# EAGLE design PSPS_AVNC_SRD_CS_combined-2021-02-07 (EAGLE 9.6.2)

## Sheet 1 of 2: Main Processor
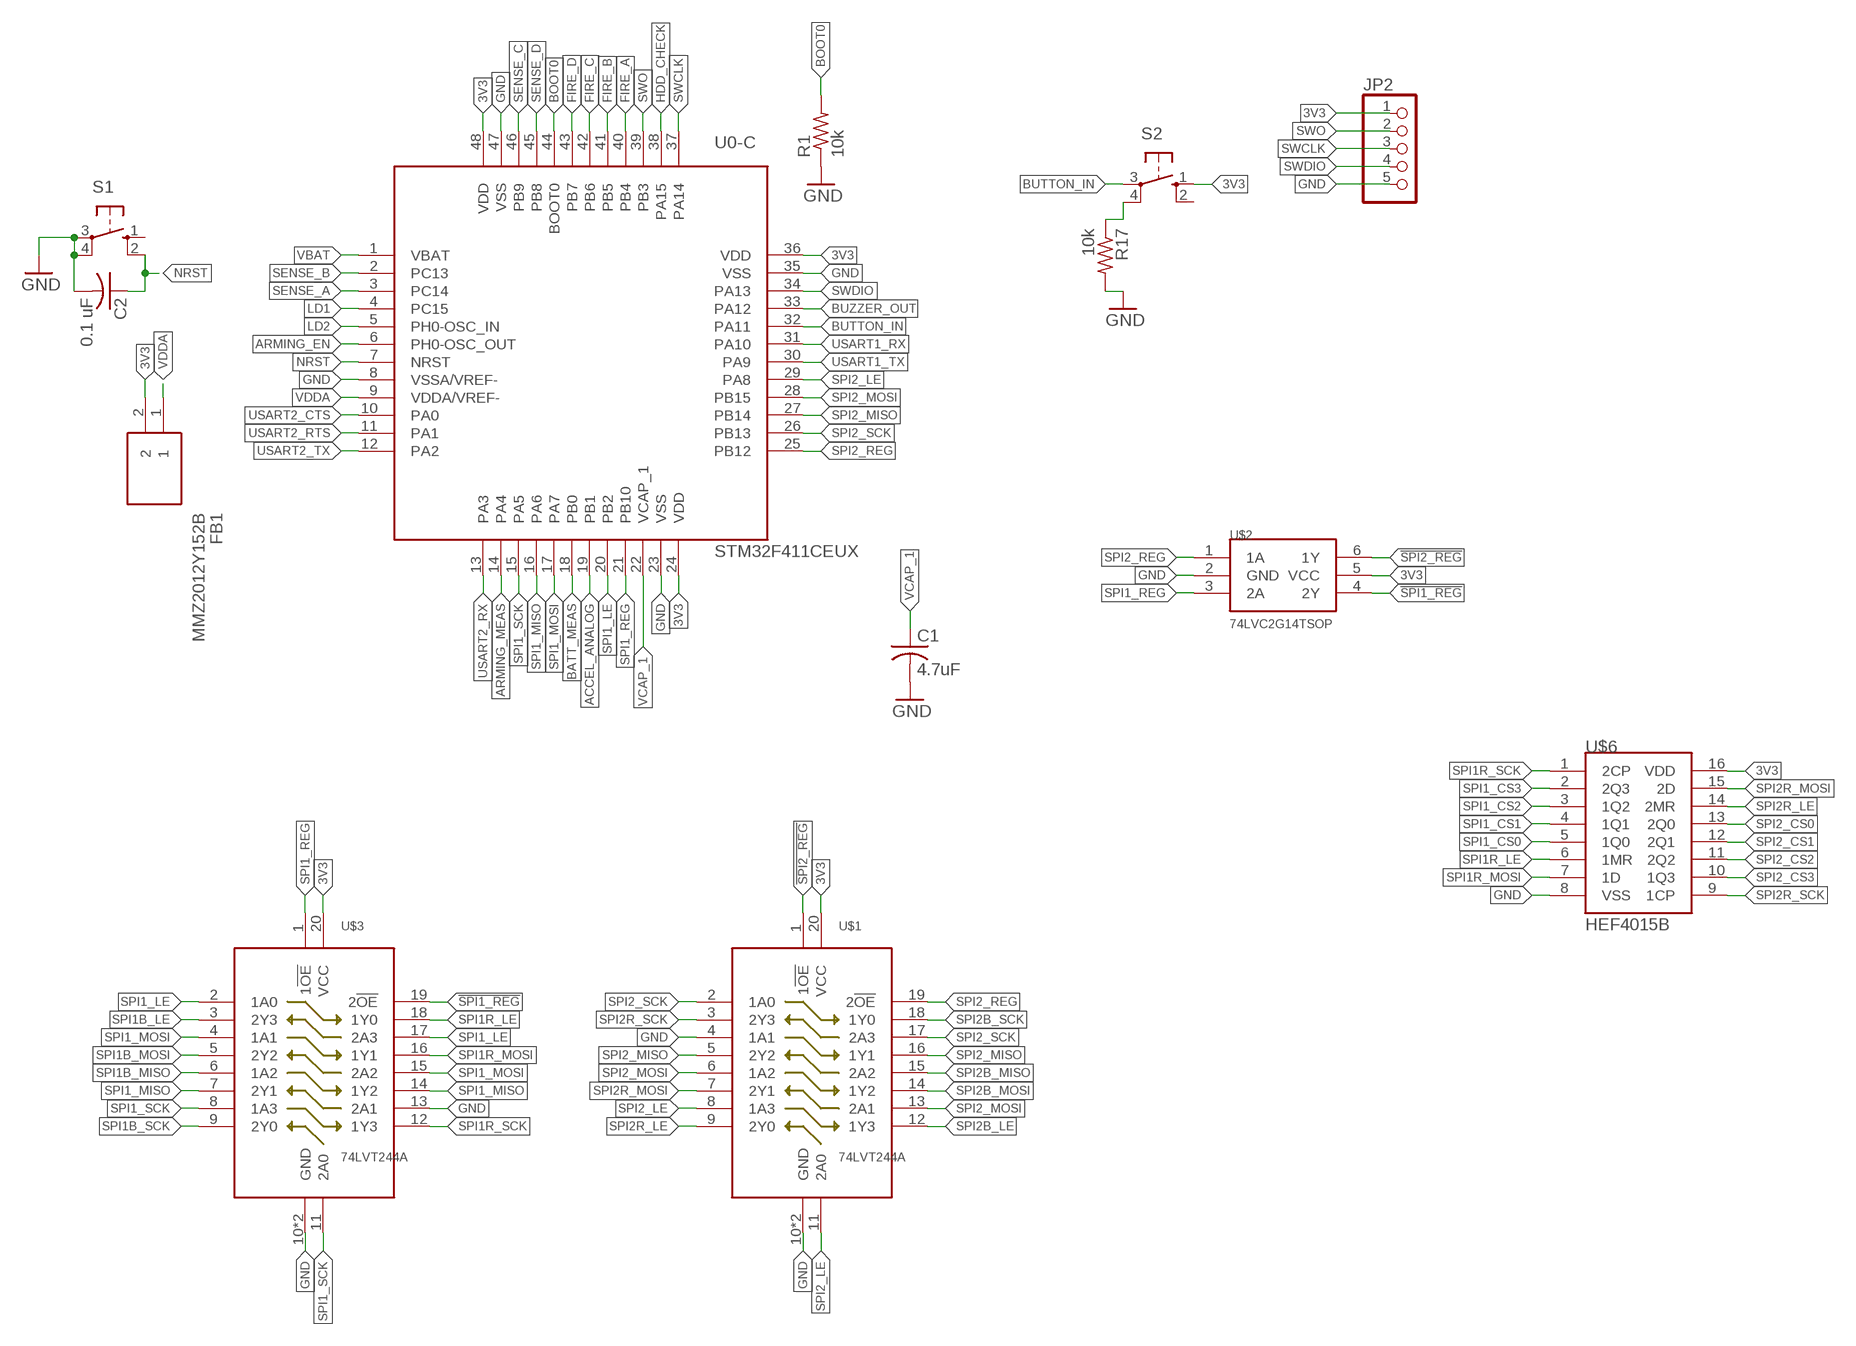
[diagram p0: schematic, sheet 1, part 1 of 2]
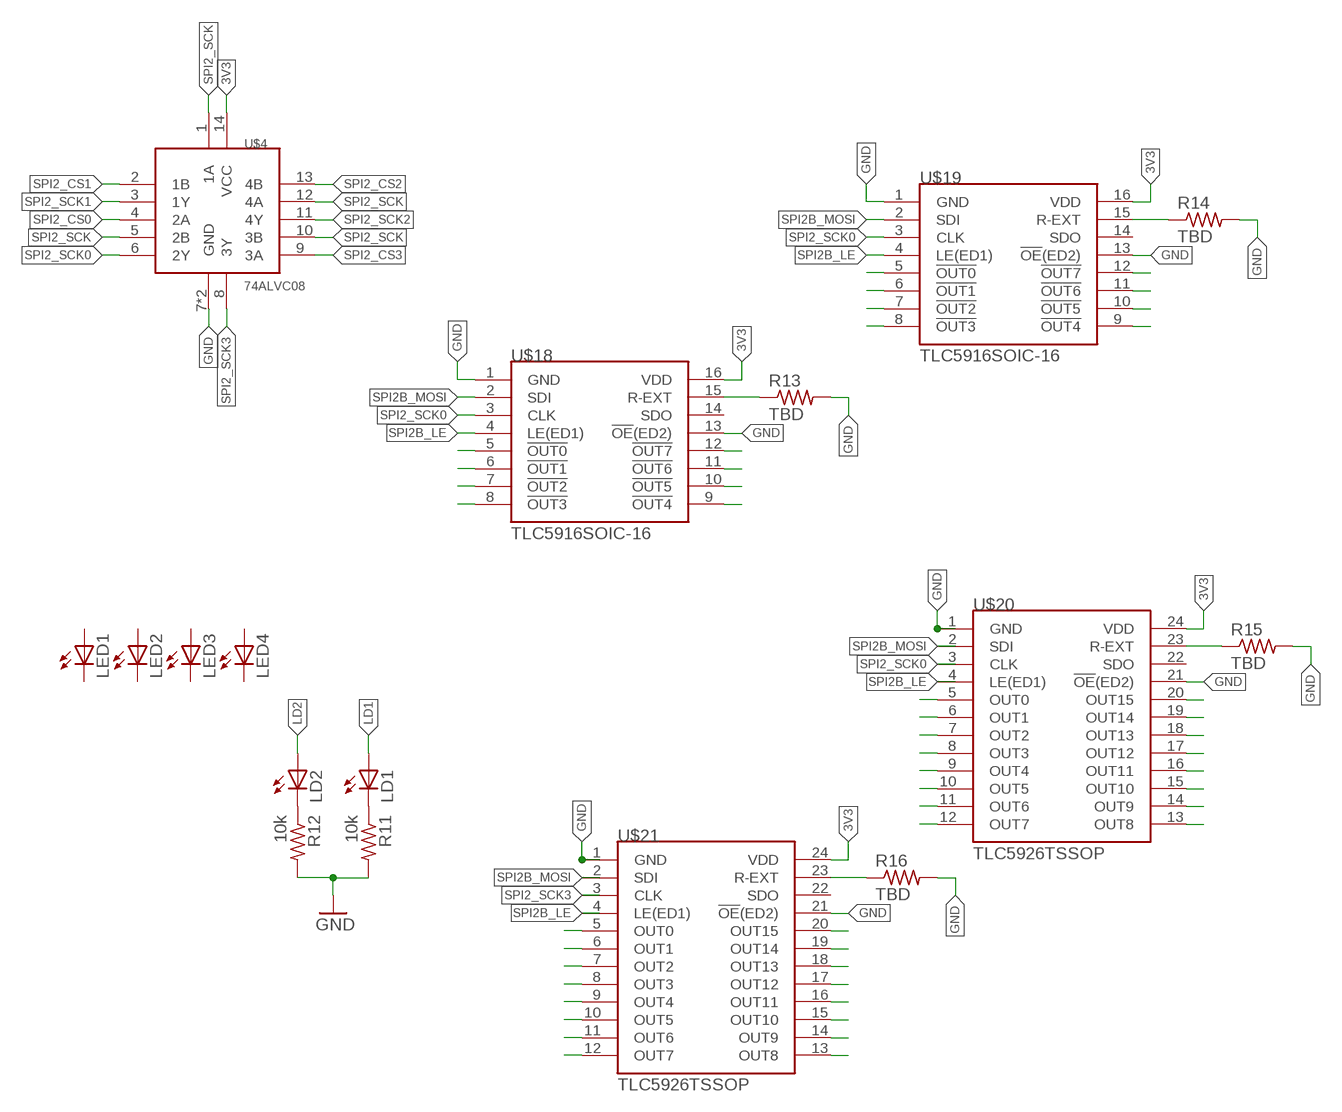
[diagram p1: schematic, sheet 1, part 2 of 2]

### Parts
C1  4.7uF  C-USC0805  [C0805]
C2  0.1 uF  C-USC0805  [C0805]
FB1  MMZ2012Y152B  [BEADC2012X105N]
JP2  PINHD-1X5  [1X05]
LD1  LEDCHIP-LED0805  [CHIP-LED0805]
LD2  LEDCHIP-LED0805  [CHIP-LED0805]
LED1  LEDCHIP-LED0805  [CHIP-LED0805]
LED2  LEDCHIP-LED0805  [CHIP-LED0805]
LED3  LEDCHIP-LED0805  [CHIP-LED0805]
LED4  LEDCHIP-LED0805  [CHIP-LED0805]
R1  10k  R-US_M0805  [M0805]
R11  10k  R-US_M0805  [M0805]
R12  10k  R-US_M0805  [M0805]
R13  TBD  R-US_M0805  [M0805]
R14  TBD  R-US_M0805  [M0805]
R15  TBD  R-US_M0805  [M0805]
R16  TBD  R-US_M0805  [M0805]
R17  10k  R-US_M0805  [M0805]
S1  10-XX  [B3F-10XX]
S2  10-XX  [B3F-10XX]
U0-C  STM32F411CEUX  [QFN50P700X700X50-49T560N]
U$1  74LVT244A  [QFN50P450X250X100-21T300X100N]
U$2  74LVC2G14TSOP  [SOP95P280X110-6N]
U$3  74LVT244A  [QFN50P450X250X100-21T300X100N]
U$4  74ALVC08  [QFN50P300X250X100-15T150X100N]
U$6  HEF4015B  [SOIC127P600X265-16N]
U$18  TLC5916SOIC-16  [SOIC127P600X175-16N]
U$19  TLC5916SOIC-16  [SOIC127P600X175-16N]
U$20  TLC5926TSSOP  [SOP65P640X120-24N]
U$21  TLC5926TSSOP  [SOP65P640X120-24N]

### Nets
3V3: FB1.2 JP2.1 S2.1(S) U0-C.24(VDD) U0-C.36(VDD) U0-C.48(VDD) U$1.20(VCC) U$2.5(VCC) U$3.20(VCC) U$4.14(VCC) U$6.16(VDD) U$18.16(VDD) U$19.16(VDD) U$20.24(VDD) U$21.24(VDD) ; also sheet 2
!SPI1_REG!: U$2.4(2Y) U$3.19(2!OE!)
!SPI2_REG!: U$1.1(1!OE!) U$2.6(1Y)
ACCEL_ANALOG: U0-C.19(PB1) ; also sheet 2
ARMING_EN: U0-C.6(PH0-OSC_OUT)
ARMING_MEAS: U0-C.14(PA4)
BATT_MEAS: U0-C.18(PB0)
BOOT0: R1.2 U0-C.44(BOOT0)
BUTTON_IN: S2.3(P) U0-C.32(PA11)
BUZZER_OUT: U0-C.33(PA12) ; also sheet 2
FIRE_A: U0-C.40(PB4)
FIRE_B: U0-C.41(PB5)
FIRE_C: U0-C.42(PB6)
FIRE_D: U0-C.43(PB7)
GND: C1.2 C2.2 JP2.5 R1.1 R11.2 R12.2 R13.2 R14.2 R15.2 R16.2 R17.2 S1.3(P) S1.4(P1) U0-C.8(VSSA/VREF-) U0-C.23(VSS) U0-C.35(VSS) U0-C.47(VSS) U$1.4(1A1) U$1.10(GND) U$1.21(GND) U$2.2(GND) U$3.10(GND) U$3.13(2A1) U$3.21(GND) U$4.7(GND) U$4.15(GND) U$6.8(VSS) U$18.1(GND) U$18.13(!OE!(ED2)) U$19.1(GND) U$19.13(!OE!(ED2)) U$20.1(GND) U$20.21(!OE!(ED2)) U$21.1(GND) U$21.21(!OE!(ED2)) ; also sheet 2
HDD_CHECK: U0-C.38(PA15)
LD1: LD1.A U0-C.4(PC15)
LD2: LD2.A U0-C.5(PH0-OSC_IN)
N$6: LD1.C R11.1
N$7: LD2.C R12.1
N$8: R13.1 U$18.15(R-EXT)
N$9: R14.1 U$19.15(R-EXT)
N$10: R15.1 U$20.23(R-EXT)
N$11: R16.1 U$21.23(R-EXT)
N$12: U$19.5(!OUT0!)
N$13: U$19.6(!OUT1!)
N$14: U$19.7(!OUT2!)
N$15: U$19.8(!OUT3)
N$16: U$19.12(!OUT7!)
N$17: U$19.11(!OUT6!)
N$18: U$19.10(!OUT5!)
N$19: U$19.9(!OUT4!)
N$20: U$18.5(!OUT0!)
N$21: U$18.6(!OUT1!)
N$22: U$18.7(!OUT2!)
N$23: U$18.8(!OUT3)
N$24: U$18.12(!OUT7!)
N$25: U$18.11(!OUT6!)
N$26: U$18.10(!OUT5!)
N$27: U$18.9(!OUT4!)
N$28: U$20.20(OUT15)
N$29: U$20.19(OUT14)
N$30: U$20.18(OUT13)
N$31: U$20.17(OUT12)
N$32: U$20.16(OUT11)
N$33: U$20.15(OUT10)
N$34: U$20.14(OUT9)
N$35: U$20.13(OUT8)
N$36: U$21.20(OUT15)
N$37: U$21.19(OUT14)
N$38: U$21.18(OUT13)
N$39: U$21.17(OUT12)
N$40: U$21.16(OUT11)
N$41: U$21.15(OUT10)
N$42: U$21.14(OUT9)
N$43: U$21.13(OUT8)
N$44: U$21.5(OUT0)
N$45: U$21.6(OUT1)
N$46: U$21.7(OUT2)
N$47: U$21.8(OUT3)
N$48: U$21.9(OUT4)
N$49: U$21.10(OUT5)
N$50: U$21.11(OUT6)
N$51: U$21.12(OUT7)
N$52: U$20.5(OUT0)
N$53: U$20.6(OUT1)
N$54: U$20.7(OUT2)
N$55: U$20.8(OUT3)
N$56: U$20.9(OUT4)
N$57: U$20.10(OUT5)
N$58: U$20.11(OUT6)
N$59: U$20.12(OUT7)
N$60: R17.1 S2.4(P1)
NRST: C2.1 S1.2(S1) U0-C.7(NRST)
SENSE_A: U0-C.3(PC14)
SENSE_B: U0-C.2(PC13)
SENSE_C: U0-C.46(PB9)
SENSE_D: U0-C.45(PB8)
SPI1_CS0: U$6.5(1Q0) ; also sheet 2
SPI1_CS1: U$6.4(1Q1) ; also sheet 2
SPI1_CS2: U$6.3(1Q2) ; also sheet 2
SPI1_CS3: U$6.2(2Q3)
SPI1_LE: U0-C.20(PB2) U$3.2(1A0) U$3.17(2A3)
SPI1_MISO: U0-C.16(PA6) U$3.7(2Y1) U$3.14(1Y2)
SPI1_MOSI: U0-C.17(PA7) U$3.4(1A1) U$3.15(2A2)
SPI1_REG: U0-C.21(PB10) U$2.3(2A) U$3.1(1!OE!)
SPI1_SCK: U0-C.15(PA5) U$3.8(1A3) U$3.11(2A0)
SPI1B_LE: U$3.3(2Y3) ; also sheet 2
SPI1B_MISO: U$3.6(1A2) ; also sheet 2
SPI1B_MOSI: U$3.5(2Y2) ; also sheet 2
SPI1B_SCK: U$3.9(2Y0) ; also sheet 2
SPI1R_LE: U$3.18(1Y0) U$6.6(1MR)
SPI1R_MOSI: U$3.16(1Y1) U$6.7(1D)
SPI1R_SCK: U$3.12(1Y3) U$6.1(2CP)
SPI2_CS0: U$4.4(2A) U$6.13(2Q0)
SPI2_CS1: U$4.2(1B) U$6.12(2Q1)
SPI2_CS2: U$4.13(4B) U$6.11(2Q2)
SPI2_CS3: U$4.9(3A) U$6.10(1Q3)
SPI2_LE: U0-C.29(PA8) U$1.8(1A3) U$1.11(2A0)
SPI2_MISO: U0-C.27(PB14) U$1.5(2Y2) U$1.16(1Y1)
SPI2_MOSI: U0-C.28(PB15) U$1.6(1A2) U$1.13(2A1)
SPI2_REG: U0-C.25(PB12) U$1.19(2!OE!) U$2.1(1A)
SPI2_SCK: U0-C.26(PB13) U$1.2(1A0) U$1.17(2A3) U$4.1(1A) U$4.5(2B) U$4.10(3B) U$4.12(4A)
SPI2_SCK0: U$4.6(2Y) U$18.3(CLK) U$19.3(CLK) U$20.3(CLK)
SPI2_SCK1: U$4.3(1Y)
SPI2_SCK2: U$4.11(4Y)
SPI2_SCK3: U$4.8(3Y) U$21.3(CLK)
SPI2B_LE: U$1.12(1Y3) U$18.4(LE(ED1)) U$19.4(LE(ED1)) U$20.4(LE(ED1)) U$21.4(LE(ED1))
SPI2B_MISO: U$1.15(2A2)
SPI2B_MOSI: U$1.14(1Y2) U$18.2(SDI) U$19.2(SDI) U$20.2(SDI) U$21.2(SDI)
SPI2B_SCK: U$1.18(1Y0)
SPI2R_LE: U$1.9(2Y0) U$6.14(2MR)
SPI2R_MOSI: U$1.7(2Y1) U$6.15(2D)
SPI2R_SCK: U$1.3(2Y3) U$6.9(1CP)
SWCLK: JP2.3 U0-C.37(PA14)
SWDIO: JP2.4 U0-C.34(PA13)
SWO: JP2.2 U0-C.39(PB3)
USART1_RX: U0-C.31(PA10) ; also sheet 2
USART1_TX: U0-C.30(PA9) ; also sheet 2
USART2_CTS: U0-C.10(PA0)
USART2_RTS: U0-C.11(PA1)
USART2_RX: U0-C.13(PA3)
USART2_TX: U0-C.12(PA2)
VBAT: U0-C.1(VBAT) ; also sheet 2
VCAP_1: C1.1 U0-C.22(VCAP_1)
VDDA: FB1.1 U0-C.9(VDDA/VREF-)
Unconnected: LED1.A LED1.C LED2.A LED2.C LED3.A LED3.C LED4.A LED4.C S1.1(S) S2.2(S1) U$18.14(SDO) U$19.14(SDO) U$20.22(SDO) U$21.22(SDO)

## Sheet 2 of 2
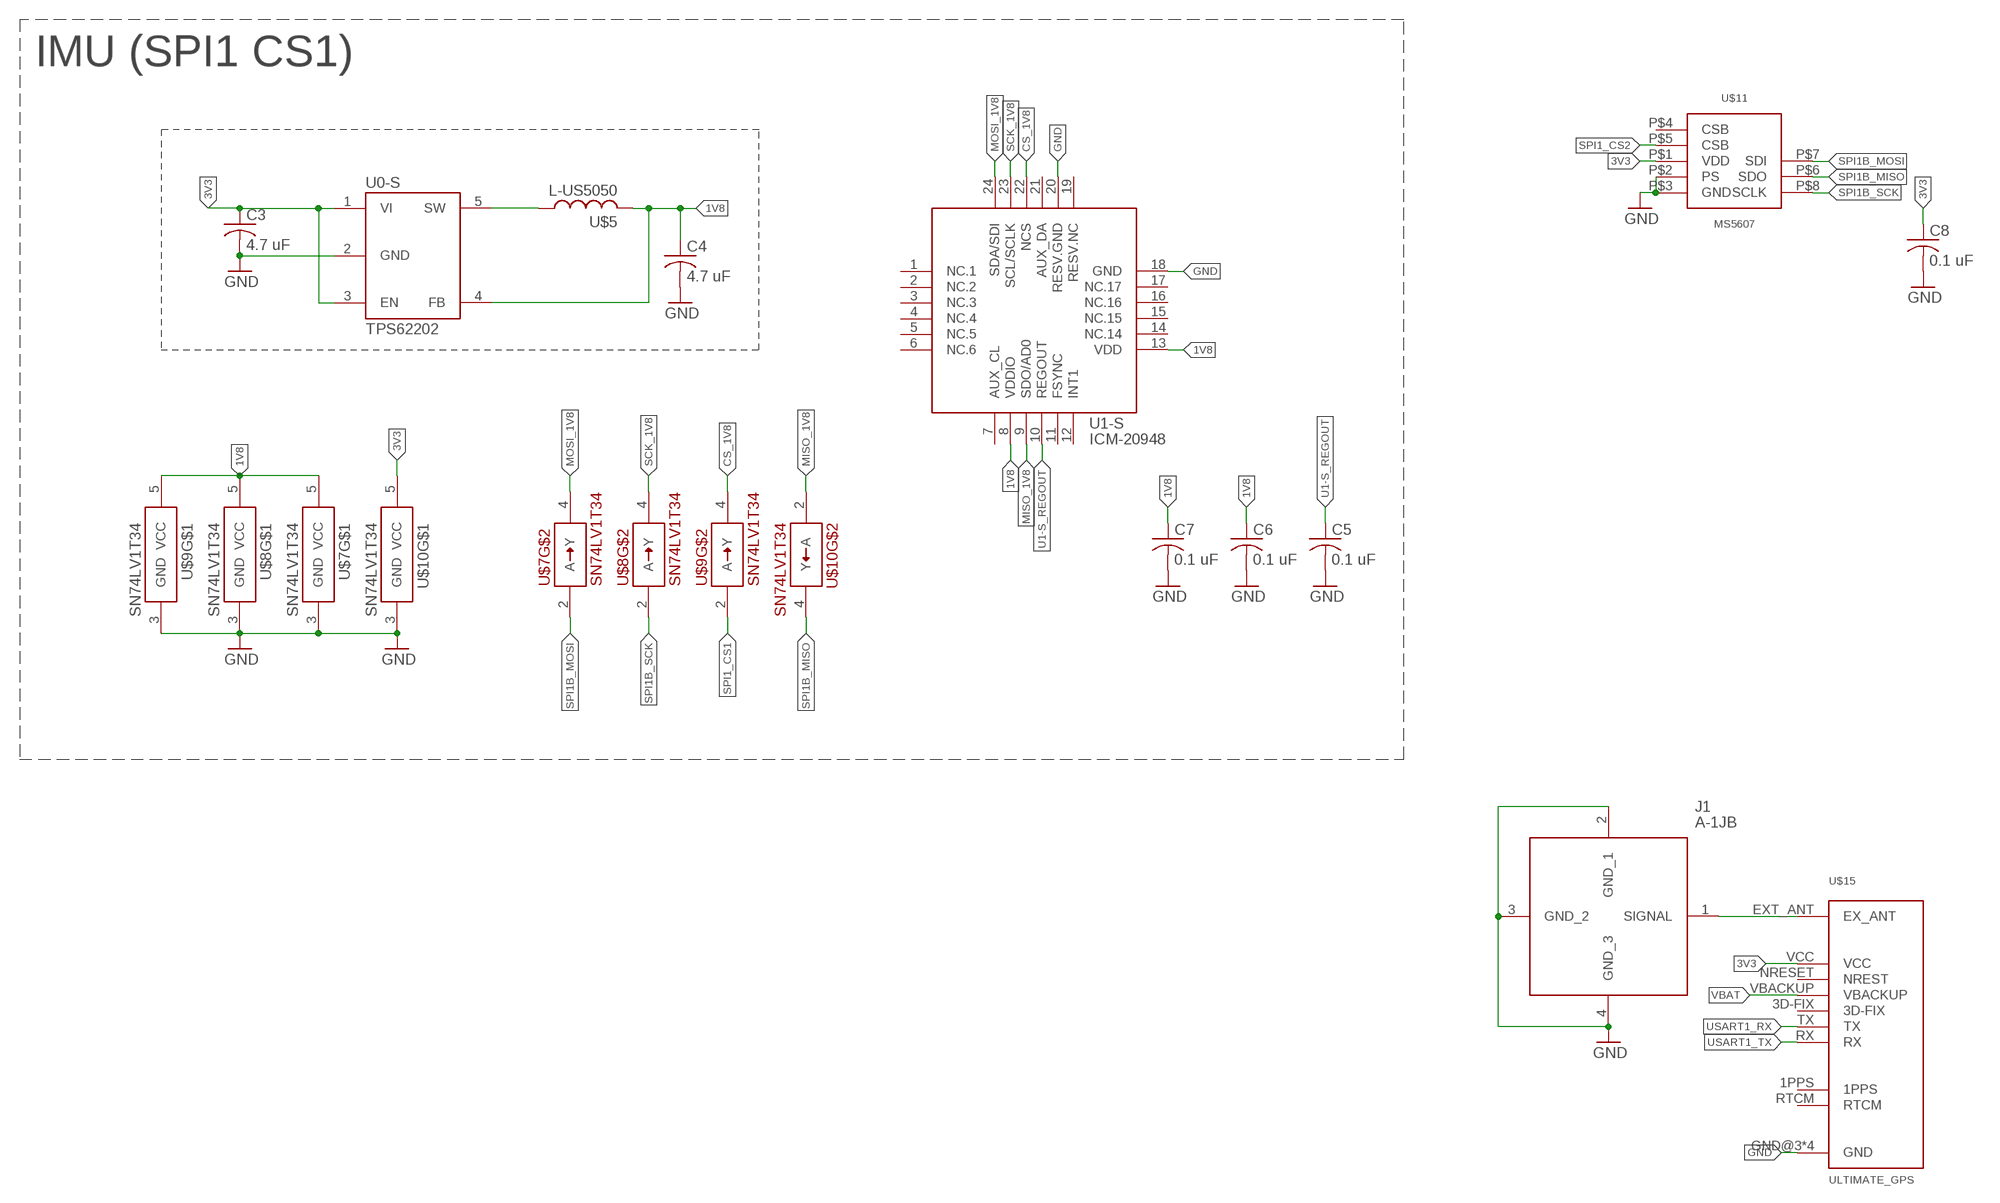
[diagram p2: schematic, sheet 2, part 1 of 2]
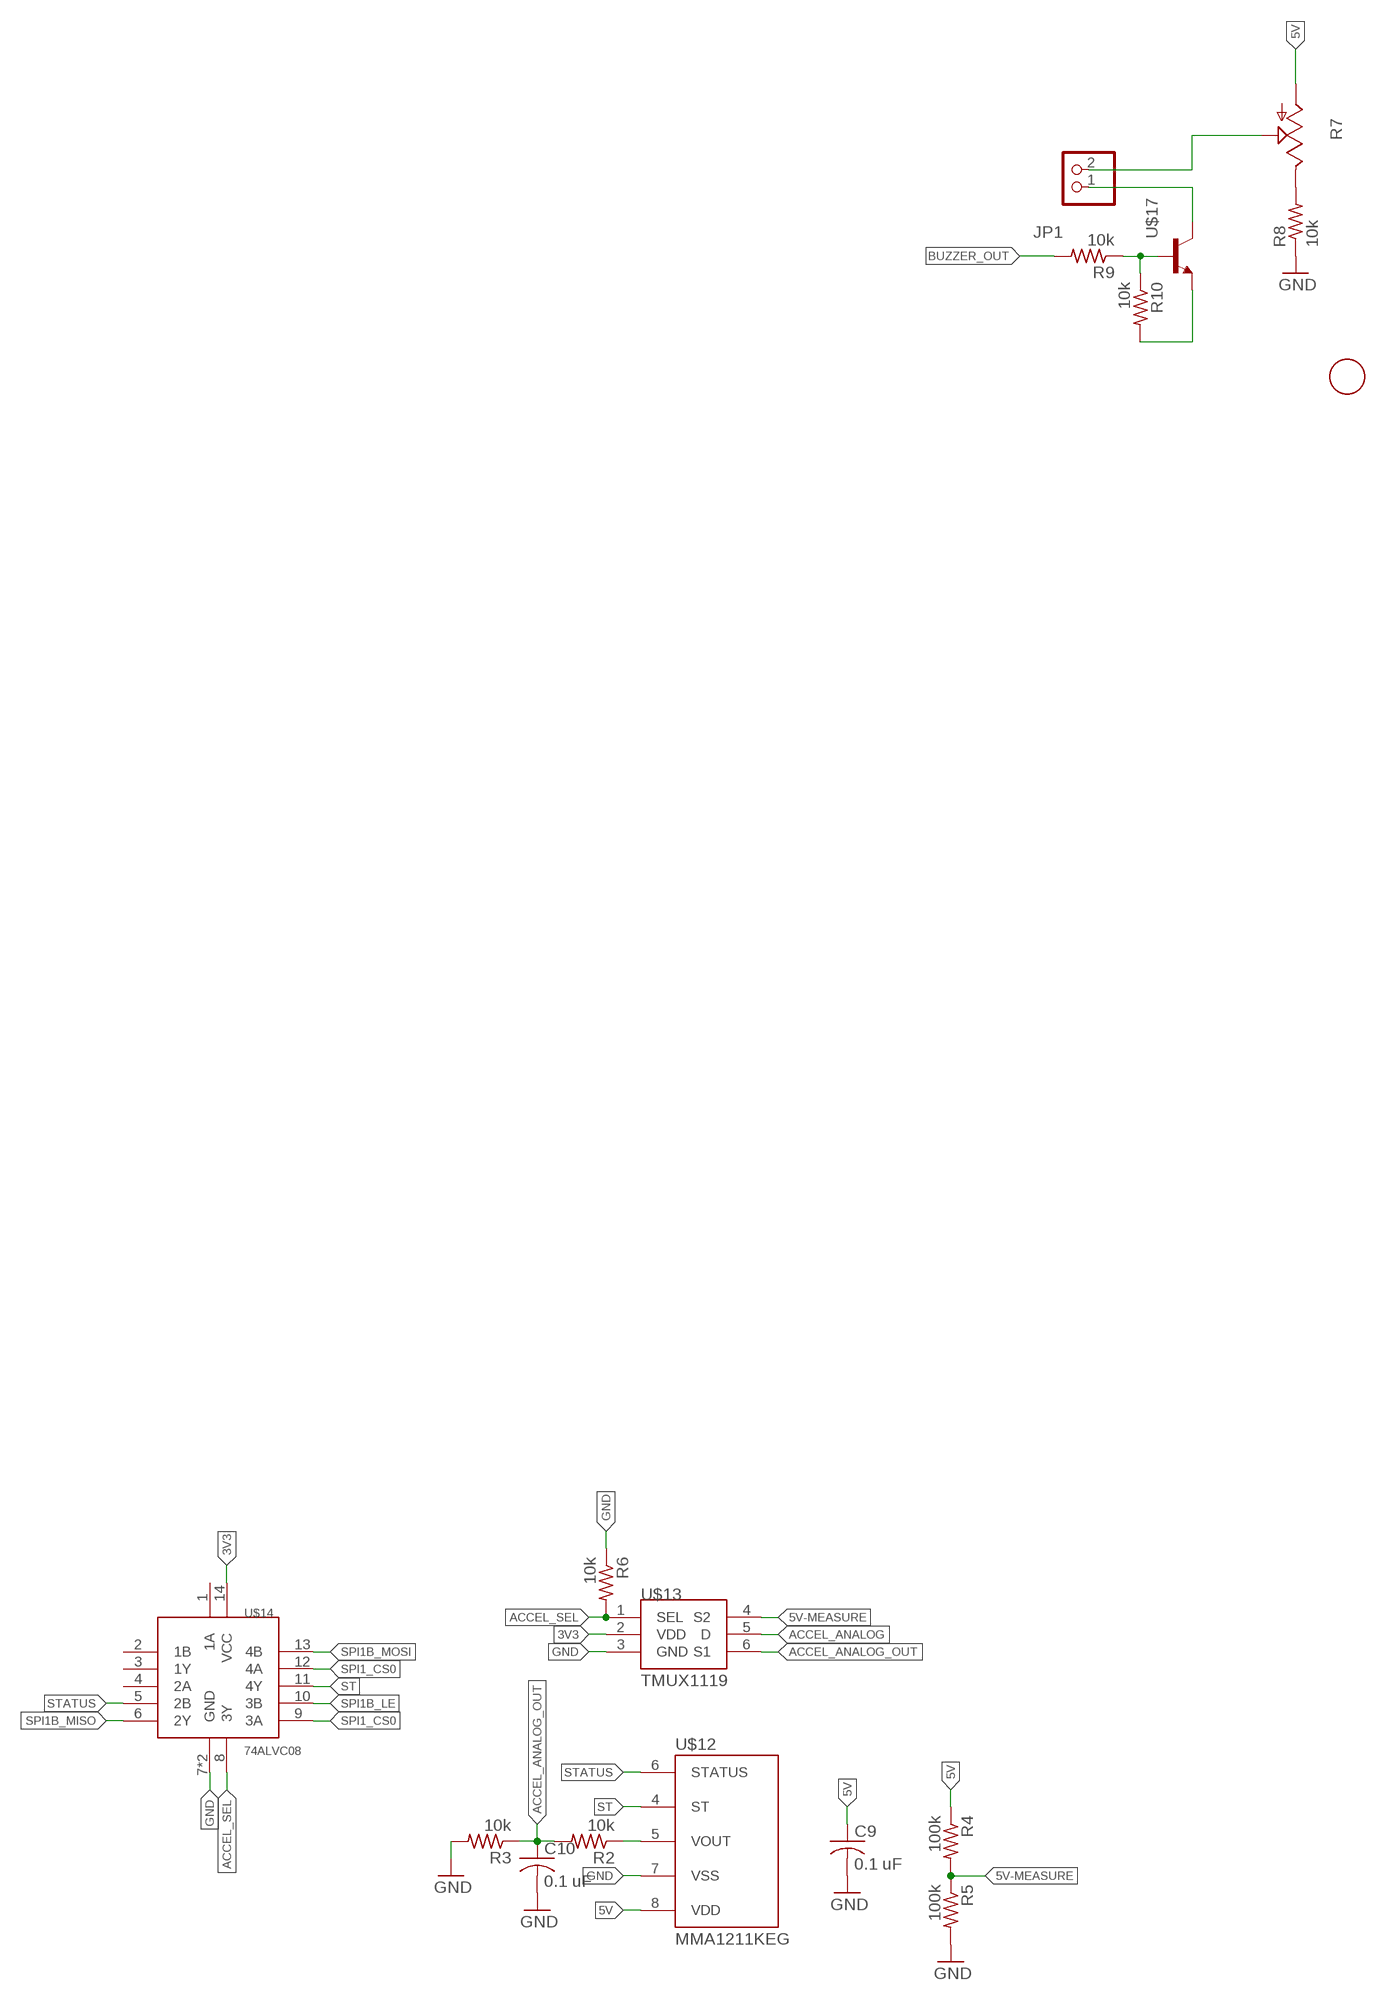
[diagram p3: schematic, sheet 2, part 2 of 2]

### Parts
C3  4.7 uF  C-USC0805  [C0805]
C4  4.7 uF  C-USC0805  [C0805]
C5  0.1 uF  C-USC0805  [C0805]
C6  0.1 uF  C-USC0805  [C0805]
C7  0.1 uF  C-USC0805  [C0805]
C8  0.1 uF  C-USC0805  [C0805]
C9  0.1 uF  C-USC0805  [C0805]
C10  0.1 uF  C-USC0805  [C0805]
J1  A-1JB  [A1JB]
JP1  PINHD-1X2  [1X02]
R2  10k  R-US_M0805  [M0805]
R3  10k  R-US_M0805  [M0805]
R4  100k  R-US_M0805  [M0805]
R5  100k  R-US_M0805  [M0805]
R6  10k  R-US_M0805  [M0805]
R7  TRIM_US-LI10  [LI10]
R8  10k  R-US_M0805  [M0805]
R9  10k  R-US_M0805  [M0805]
R10  10k  R-US_M0805  [M0805]
U0-S  TPS62202  [SOT95P280X145-5]
U1-S  ICM-20948  [QFN40P300X300X105-25T159X175]
U$5  L-US5050  [INDDFN1250X1250X600-2N]
U$7  SN74LV1T34  [SOT65P210X110-5]
U$8  SN74LV1T34  [SOT65P210X110-5]
U$9  SN74LV1T34  [SOT65P210X110-5]
U$10  SN74LV1T34  [SOT65P210X110-5]
U$11  MS5607  [MS5607]
U$12  MMA1211KEG  [SOIC127P1041X355-16N]
U$13  TMUX1119  [SOP95P280X145-6N]
U$14  74ALVC08  [QFN50P300X250X100-15T150X100N]
U$15  ULTIMATE_GPS  [FGPMMOPA6H]
U$16  UXCELL_BUZZER  [UXCELL_BUZZER]
U$17  NPN_TRANSISTOR  [SOT23]

### Nets
1V8: C4.1 C6.1 C7.1 U0-S.4(FB) U1-S.8(VDDIO) U1-S.13(VDD) U$5.2 U$7.5(VCC) U$8.5(VCC) U$9.5(VCC)
3V3: C3.1 C8.1 U0-S.1(VI) U0-S.3(EN) U$10.5(VCC) U$11.P$1(VDD) U$13.2(VDD) U$14.14(VCC) U$15.VCC ; also sheet 1
5V: C9.1 R4.1 R7.A U$12.8(VDD)
5V-MEASURE: R4.2 R5.1 U$13.4(S2)
ACCEL_ANALOG: U$13.5(D) ; also sheet 1
ACCEL_ANALOG_OUT: C10.1 R2.2 R3.1 U$13.6(S1)
ACCEL_SEL: R6.2 U$13.1(SEL) U$14.8(3Y)
BUZZER_OUT: R9.2 ; also sheet 1
CS_1V8: U1-S.22(NCS) U$9.4(Y)
EXT-ANT: J1.1(SIGNAL) U$15.EXT_ANT(EX_ANT)
GND: C3.2 C4.2 C5.2 C6.2 C7.2 C8.2 C9.2 C10.2 J1.2(GND_1) J1.3(GND_2) J1.4(GND_3) R3.2 R5.2 R6.1 R8.1 U0-S.2(GND) U1-S.18(GND) U1-S.20(RESV.GND) U$7.3(GND) U$8.3(GND) U$9.3(GND) U$10.3(GND) U$11.P$2(PS) U$11.P$3(GND) U$12.7(VSS) U$13.3(GND) U$14.7(GND) U$14.15(GND) U$15.GND@3(GND) U$15.GND@8(GND) U$15.GND@12(GND) U$15.GND@19(GND) ; also sheet 1
MISO_1V8: U1-S.9(SDO/AD0) U$10.2(A)
MOSI_1V8: U1-S.24(SDA/SDI) U$7.4(Y)
N$1: JP1.2 R7.S
N$2: JP1.1 U$17.2(C)
N$3: R7.E R8.2
N$4: R9.1 R10.1 U$17.1(B)
N$5: R10.2 U$17.3(E)
SCK_1V8: U1-S.23(SCL/SCLK) U$8.4(Y)
SPI1_CS0: U$14.9(3A) U$14.12(4A) ; also sheet 1
SPI1_CS1: U$9.2(A) ; also sheet 1
SPI1_CS2: U$11.P$5(CSB) ; also sheet 1
SPI1B_LE: U$14.10(3B) ; also sheet 1
SPI1B_MISO: U$10.4(Y) U$11.P$6(SDO) U$14.6(2Y) ; also sheet 1
SPI1B_MOSI: U$7.2(A) U$11.P$7(SDI) U$14.13(4B) ; also sheet 1
SPI1B_SCK: U$8.2(A) U$11.P$8(SCLK) ; also sheet 1
ST: U$12.4(ST) U$14.11(4Y)
STATUS: U$12.6(STATUS) U$14.5(2B)
U0-S_SW: U0-S.5(SW) U$5.1
U0-S_VOUT: R2.1 U$12.5(VOUT)
U1-S_REGOUT: C5.1 U1-S.10(REGOUT)
USART1_RX: U$15.TX ; also sheet 1
USART1_TX: U$15.RX ; also sheet 1
VBAT: U$15.VBACKUP ; also sheet 1
Unconnected: U1-S.1(NC.1) U1-S.2(NC.2) U1-S.3(NC.3) U1-S.4(NC.4) U1-S.5(NC.5) U1-S.6(NC.6) U1-S.7(AUX_CL) U1-S.11(FSYNC) U1-S.12(INT1) U1-S.14(NC.14) U1-S.15(NC.15) U1-S.16(NC.16) U1-S.17(NC.17) U1-S.19(RESV.NC) U1-S.21(AUX_DA) U$11.P$4(CSB) U$14.1(1A) U$14.2(1B) U$14.3(1Y) U$14.4(2A) U$15.1PPS U$15.3D-FIX U$15.NRESET(NREST) U$15.RTCM

### Notes on the sheet
- IMU (SPI1 CS1)

## Library data of the parts
C1-C10 = resistor:C-US: CAPACITOR, American symbol
FB1 = Computer2:MMZ2012Y152B: Ferrite bead SMD 1500Ohm 500mA TDK Ferrite Bead (Chip Bead), 2 x 1.25 x 0.85mm (0805) Source: Datasheet <https://componentsearchengine.com/Datasheets/1/MMZ2012Y152B.pdf>; DESCRIPTION: Ferrite bead SMD 1500Ohm 500mA TDK Ferrite Bead (Chip Bead), 2 x 1.25 x 0.85mm (0805); HEIGHT: 1.05mm; MANUFACTURER_NAME: TDK; MANUFACTURER_PART_NUMBER: MMZ2012Y152B; MOUSER_PART_NUMBER: 810-MMZ2012Y152B; MOUSER_PRICE-STOCK: https://www.mouser.com/Search/Refine.aspx?Keyword=810-MMZ2012Y152B
J1 = SamacSys_Parts:A-1JB: AMC Straight PCB Jack, Surface Mount Source: Datasheet <https://componentsearchengine.com/Datasheets/1/A-1JB.pdf>; DESCRIPTION: AMC Straight PCB Jack, Surface Mount; HEIGHT: 1.05mm; MANUFACTURER_NAME: Amphenol; MANUFACTURER_PART_NUMBER: A-1JB; MOUSER_PART_NUMBER: 523-A-1JB; MOUSER_PRICE-STOCK: https://www.mouser.com/Search/Refine.aspx?Keyword=523-A-1JB
JP1 = pinhead:PINHD-1X2: PIN HEADER
JP2 = pinhead:PINHD-1X5: PIN HEADER
LD1 LD2 LED1-LED4 = adafruit:LED: LED OSRAM: - CHIPLED LG R971, LG N971, LY N971, LG Q971, LY Q971, LO R971, LY R971 LH N974, LH R974 LS Q976, LO Q976, LY Q976 LO Q996 - Hyper CHIPLED LW Q18S LB Q993, LB Q99A, LB R99A - SideLED LS A670, LO A670, LY A670, LG A670, LP A670 LB A673, LV A673, LT A673, LW A673 LH A674 LY A675 LS A676, LA A676, LO A676, LY A676, LW A676 LS A679, LY A679, LG A679 - Hyper Micro SIDELED® LS Y876, LA Y876, LO Y876, LY Y876 LT Y87S - SmartLED LW L88C, LW L88S LB L89C, LB L89S, LG L890 LS L89K, LO L89K, LY L89K LS L896, LA L896, LO L896, LY L896 - TOPLED LS T670, LO T670, LY T670, LG T670, LP T670 LSG T670, LSP T670, LSY T670, LOP T670, LYG T670 LG T671, LOG T671, LSG T671 LB T673, LV T673, LT T673, LW T673 LH T674 LS T676, LA T676, LO T676, LY T676, LB T676, LH T676, LSB T676, LW T676 LB T67C, LV T67C, LT T67C, LS T67K, LO T67K, LY T67K, LW E67C LS E67B, LA E67B, LO E67B, LY E67B, LB E67C, LV E67C, LT E67C LW T67C LS T679, LY T679, LG T679 LS T770, LO T770, LY T770, LG T770, LP T770 LB T773, LV T773, LT T773, LW T773 LH T774 LS E675, LA E675, LY E675, LS T675 LS T776, LA T776, LO T776, LY T776, LB T776 LHGB T686 LT T68C, LB T68C - Hyper Mini TOPLED® LB M676 - Mini TOPLED Santana® LG M470 LS M47K, LO M47K, LY M47K Source: http://www.osram.convergy.de/
R1-R6 R8-R17 = resistor:R-US_: RESISTOR, American symbol
R7 = pot:TRIM_US-: POTENTIOMETER
S1 S2 = switch-omron:10-XX: OMRON SWITCH; MPN: B3F-1000; OC_FARNELL: 176432; OC_NEWARK: 36M3542
U0-C = Computer2:STM32F411CEUX: STM32F411CEUx https://www.mouser.com/ProductDetail/STMicroelectronics/STM32F411CEU7/?qs=k5OWtXsTJaprF2FuhgNRlw%3D%3D
U0-S = Computer2:TPS62202: 1.8-V Output, 300-mA, 95% Efficient Step-Down Converter in SOT-23 http://www.ti.com/product/TPS62202
U1-S = Computer2:ICM-20948: 9 Axis Motion Sensor from TDK InvenSense https://store.invensense.com/products/detail/ICM20948-InvenSense/597203/
U$1 U$3 = Computer2:74LVT244A: 3.3 V octal buffer/line driver; 3-state (split) https://www.mouser.com/ProductDetail/Nexperia/74LVT244ABQ115/?qs=me8TqzrmIYX0op6H%252BBs37A%3D%3D
U$2 = Computer2:74LVC2G14: Dual inverting Schmitt trigger with 5 V tolerant input https://www.mouser.com/ProductDetail/Nexperia/74LVC2G14GF132/?qs=me8TqzrmIYXgua1MCaM%2FQg%3D%3D
U$4 U$14 = Computer2:74ALVC08: Quad 2-input AND Gate
U$5 = Computer2:L-US
U$6 = Computer2:HEF4015B
U$7-U$10 = Computer2:SN74LV1T34: Single Power Supply BUFFER Logic Level Shifter
U$11 = Computer2:MS5607
U$12 = Computer2:MMA1211KEG
U$13 = Computer2:TMUX1119: Analog Switch IC (Multiplexer) https://www.mouser.com/ProductDetail/Texas-Instruments/TMUX1119DBVR/?qs=9r4v7xj2Lnn%2FqYCDWCSZ7w%3D%3D
U$15 = Computer2:ULTIMATE_GPS
U$16 = Flight Computer Parts:UXCELL_BUZZER
U$17 = Flight Computer Parts:NPN_TRANSISTOR
U$18 U$19 = Computer2:TLC5916: LED Sink Driver https://www.ti.com/lit/ds/symlink/tlc5916.pdf?ts=1603064696816&ref_url=https%253A%252F%252Fwww.ti.com%252Fproduct%252FTLC5916
U$20 U$21 = Computer2:TLC5926

## Board
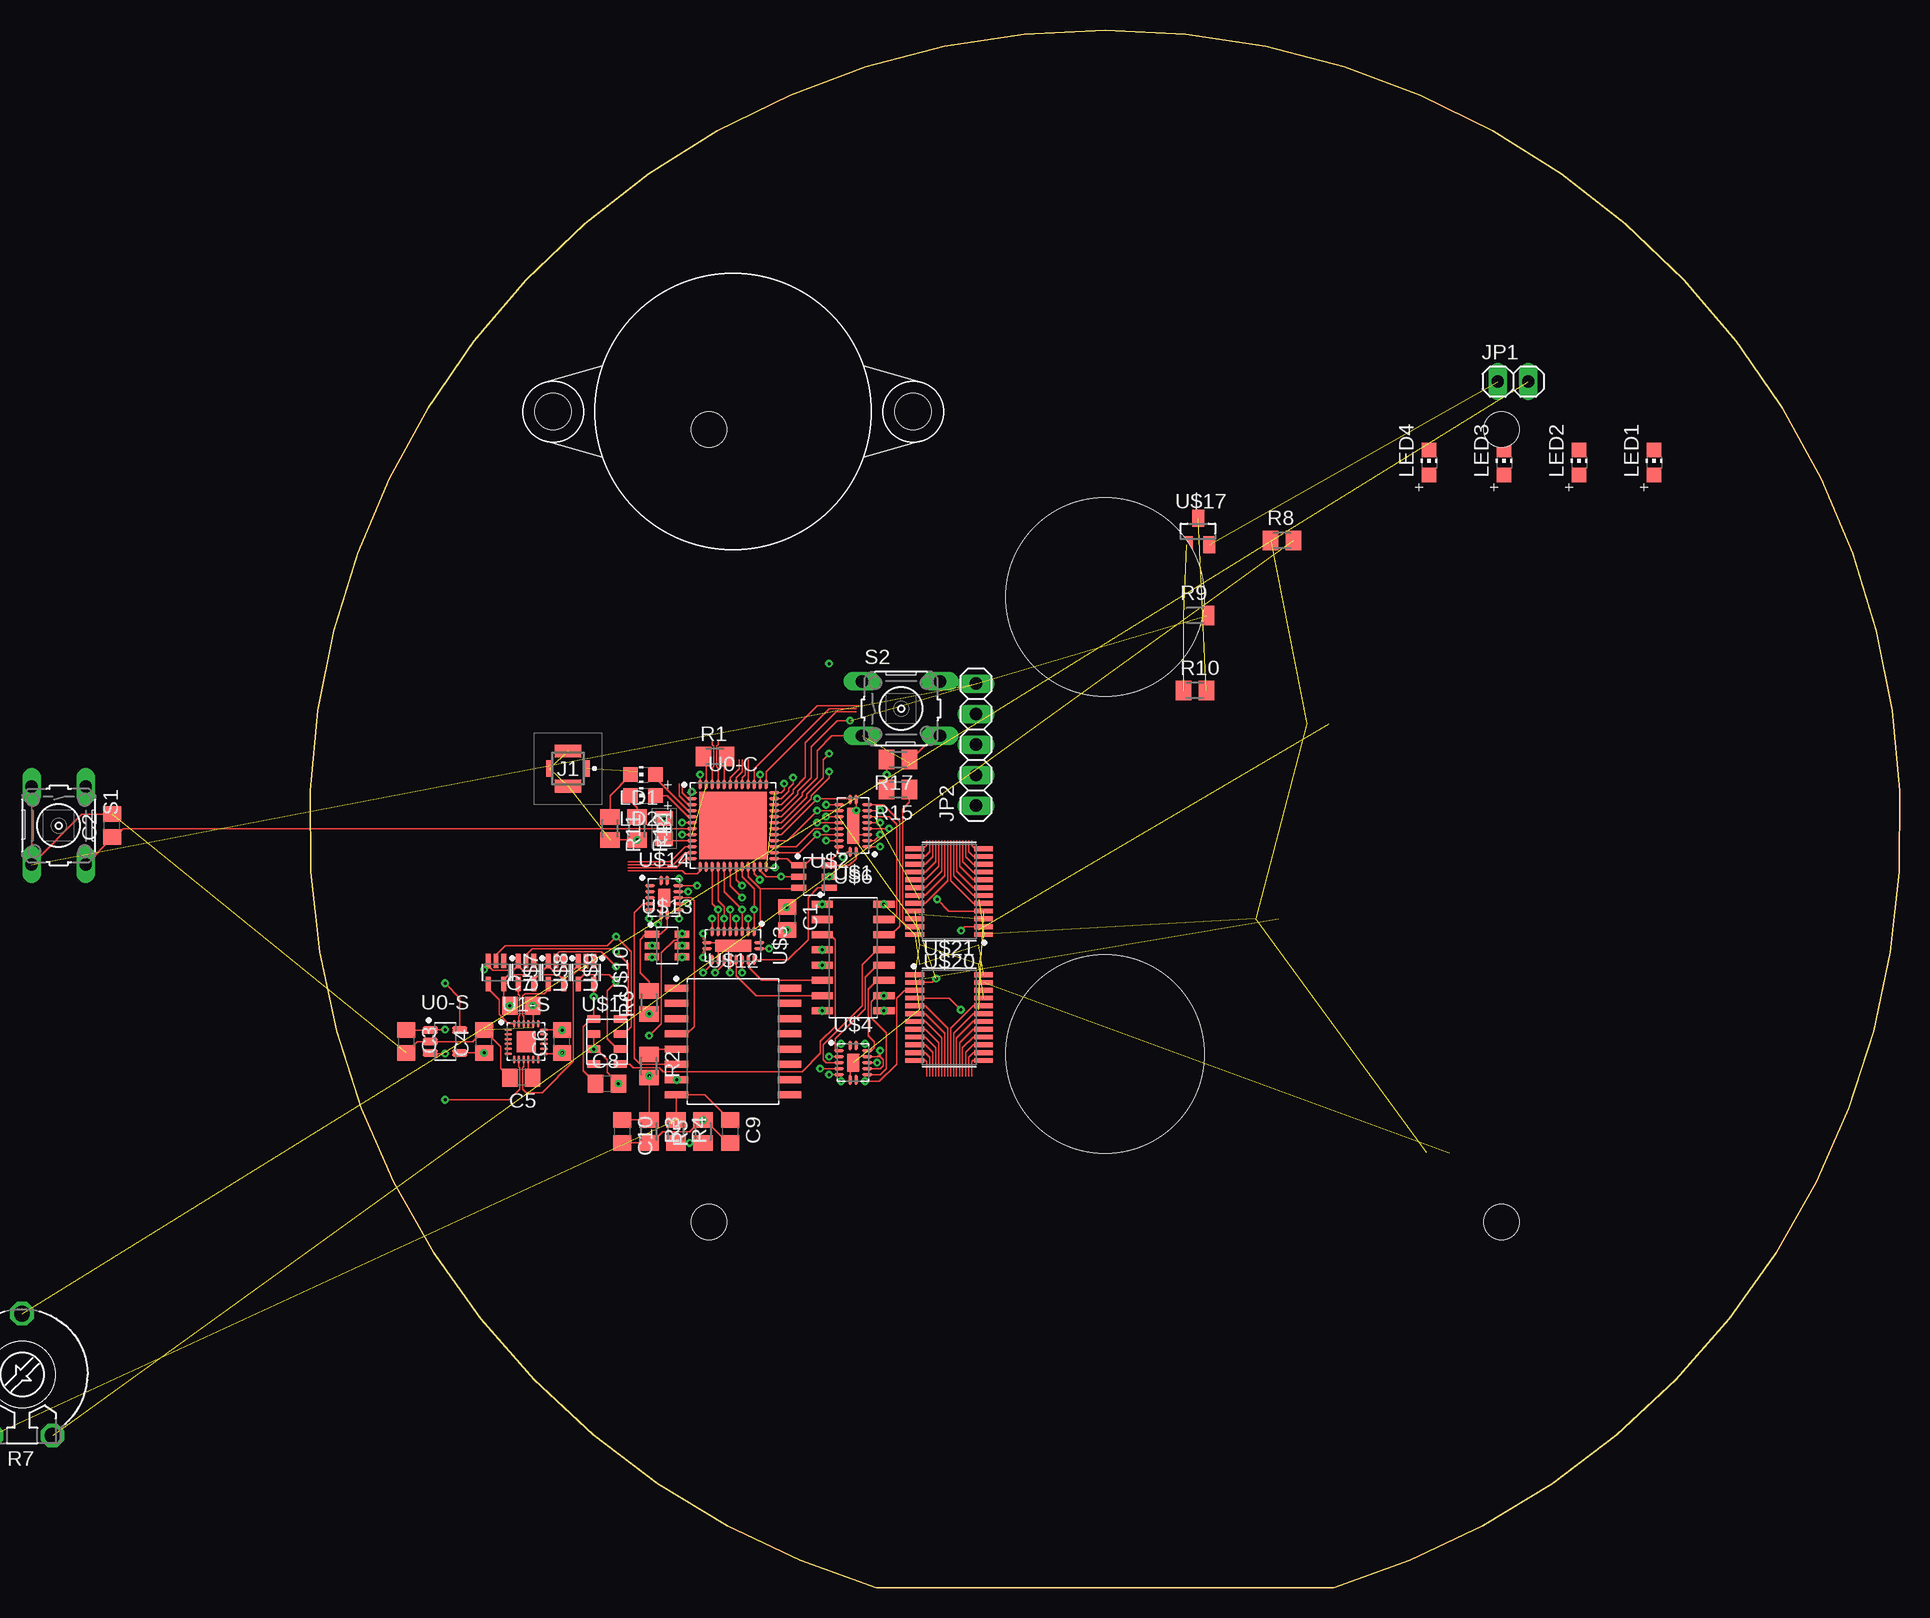
[diagram p4: board, top side]
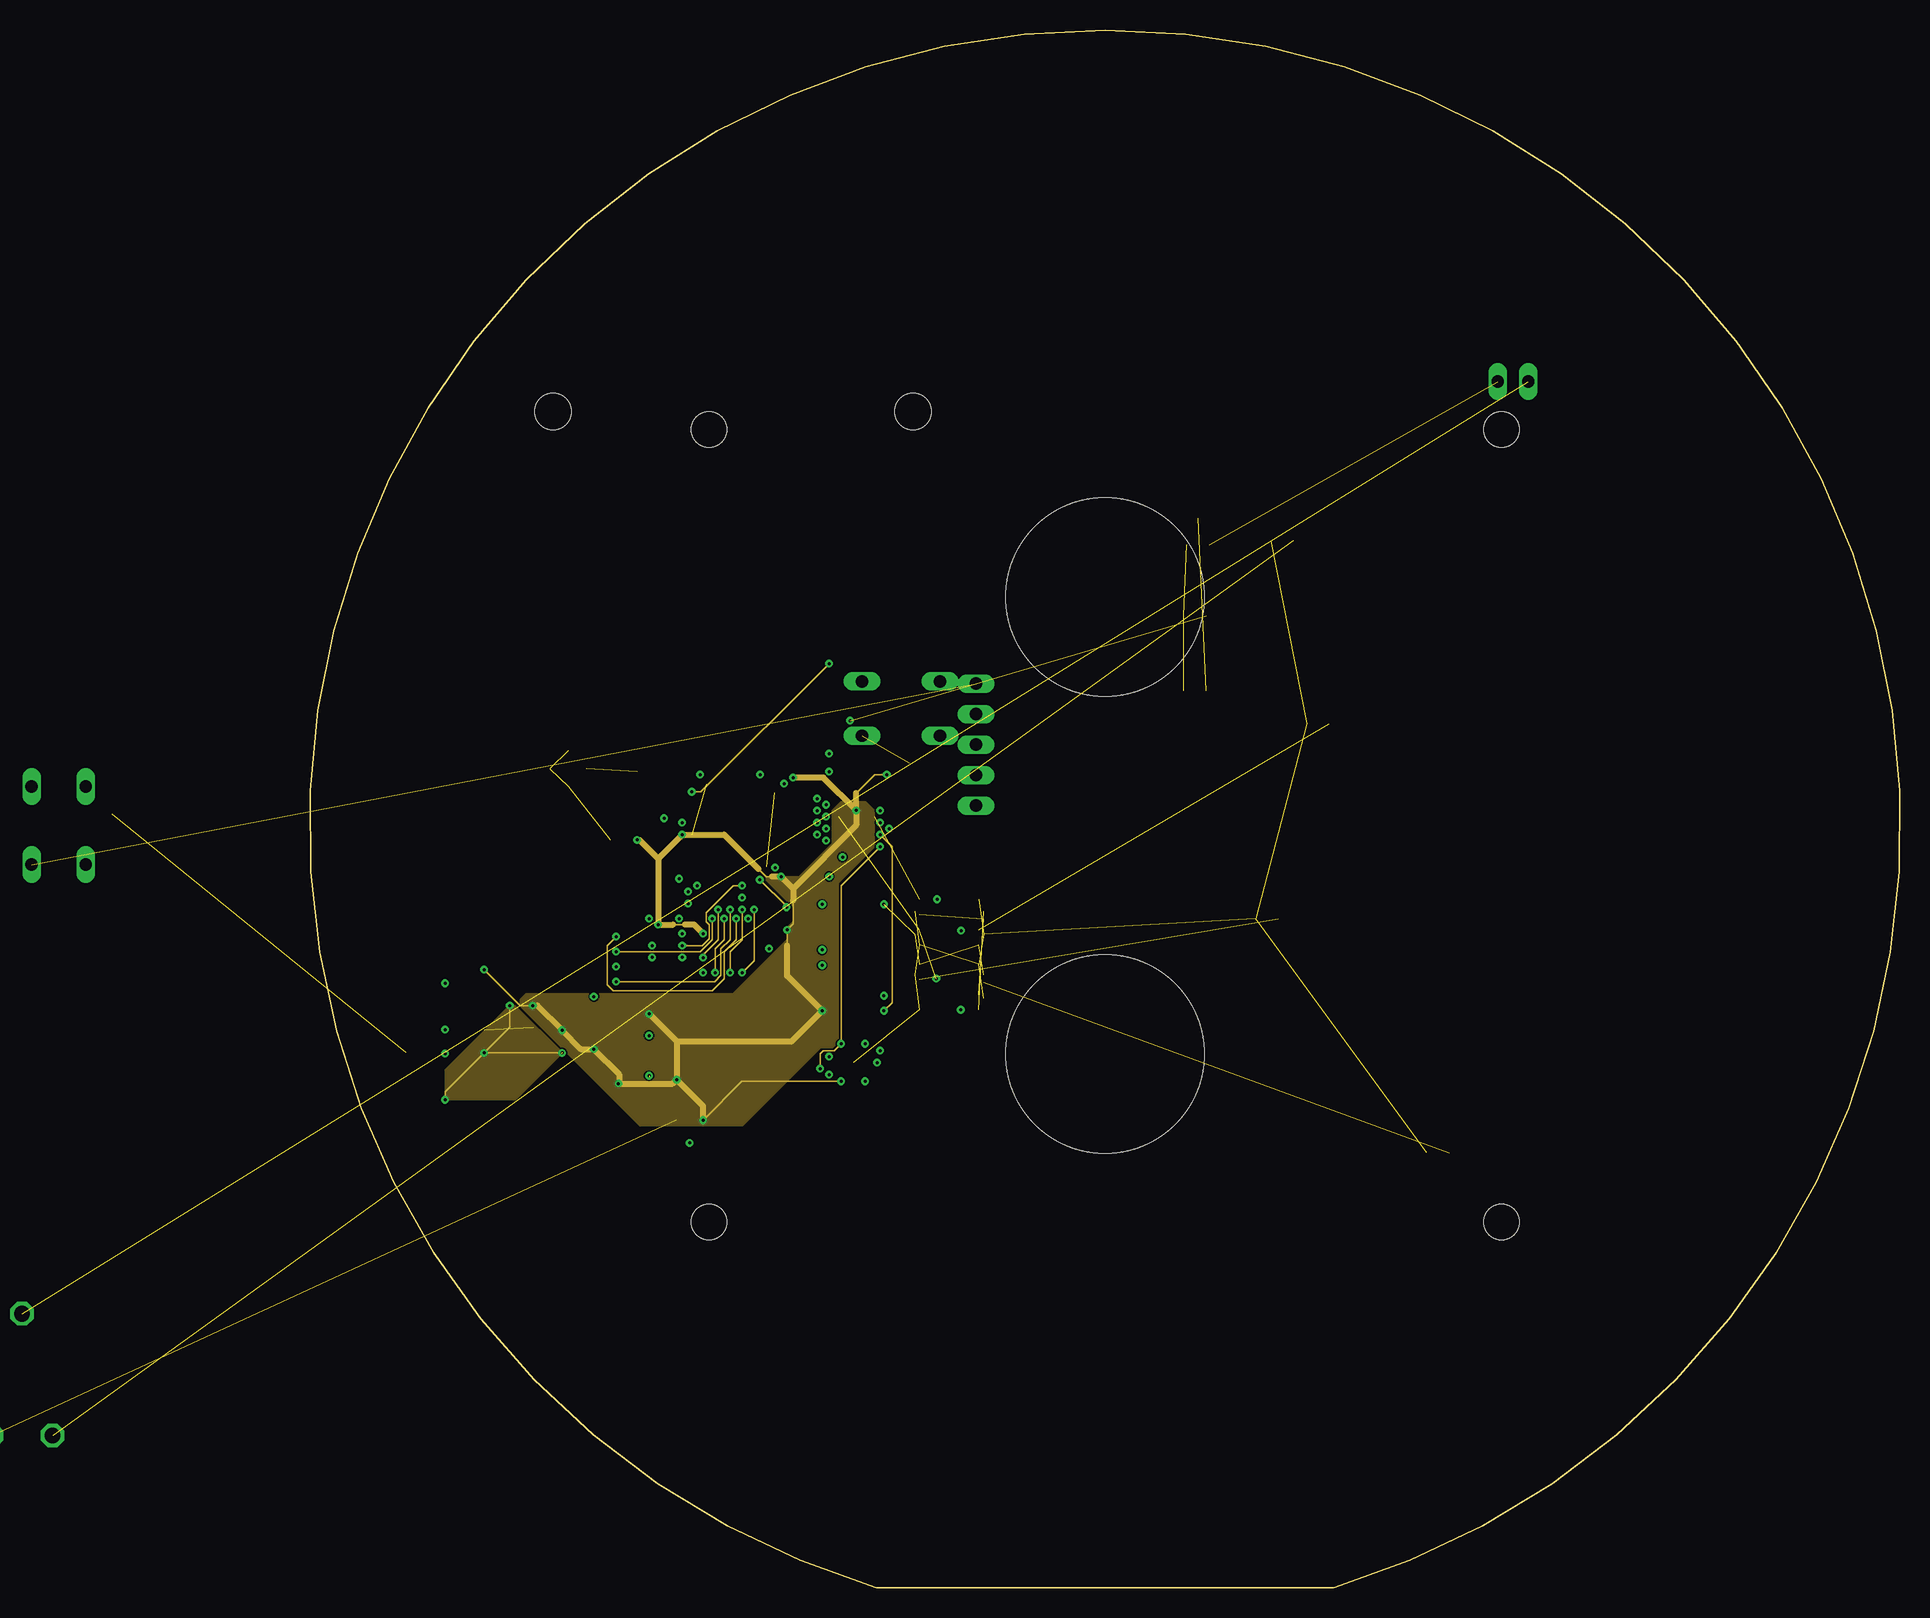
[diagram p5: board, inner layer Route2]
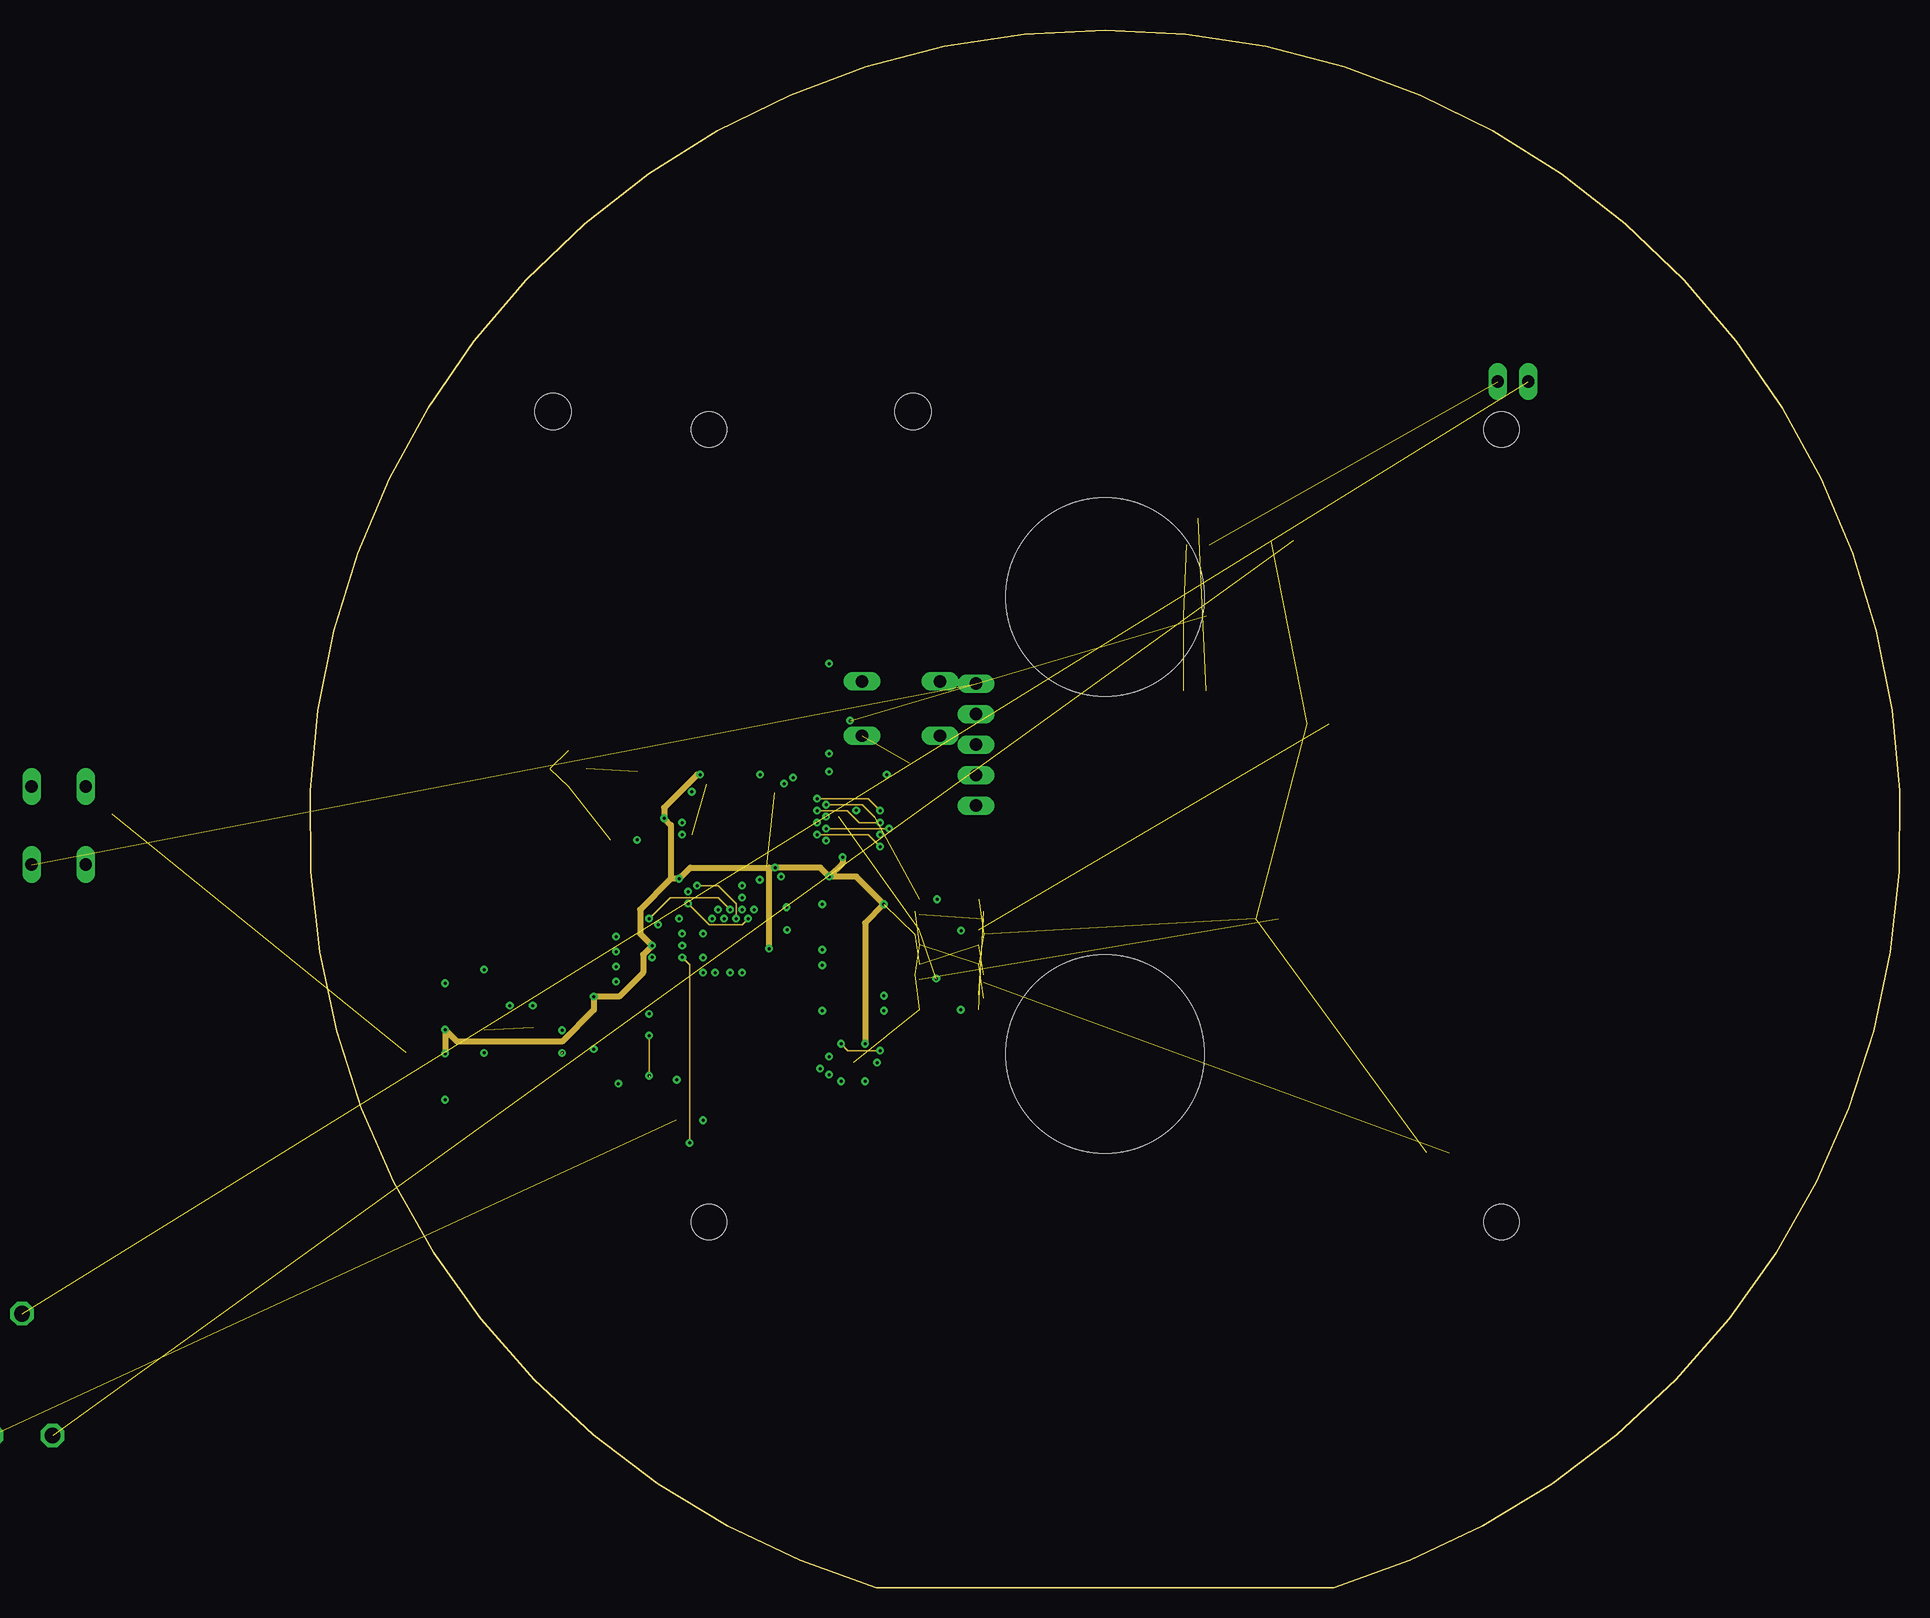
[diagram p6: board, inner layer Route15]
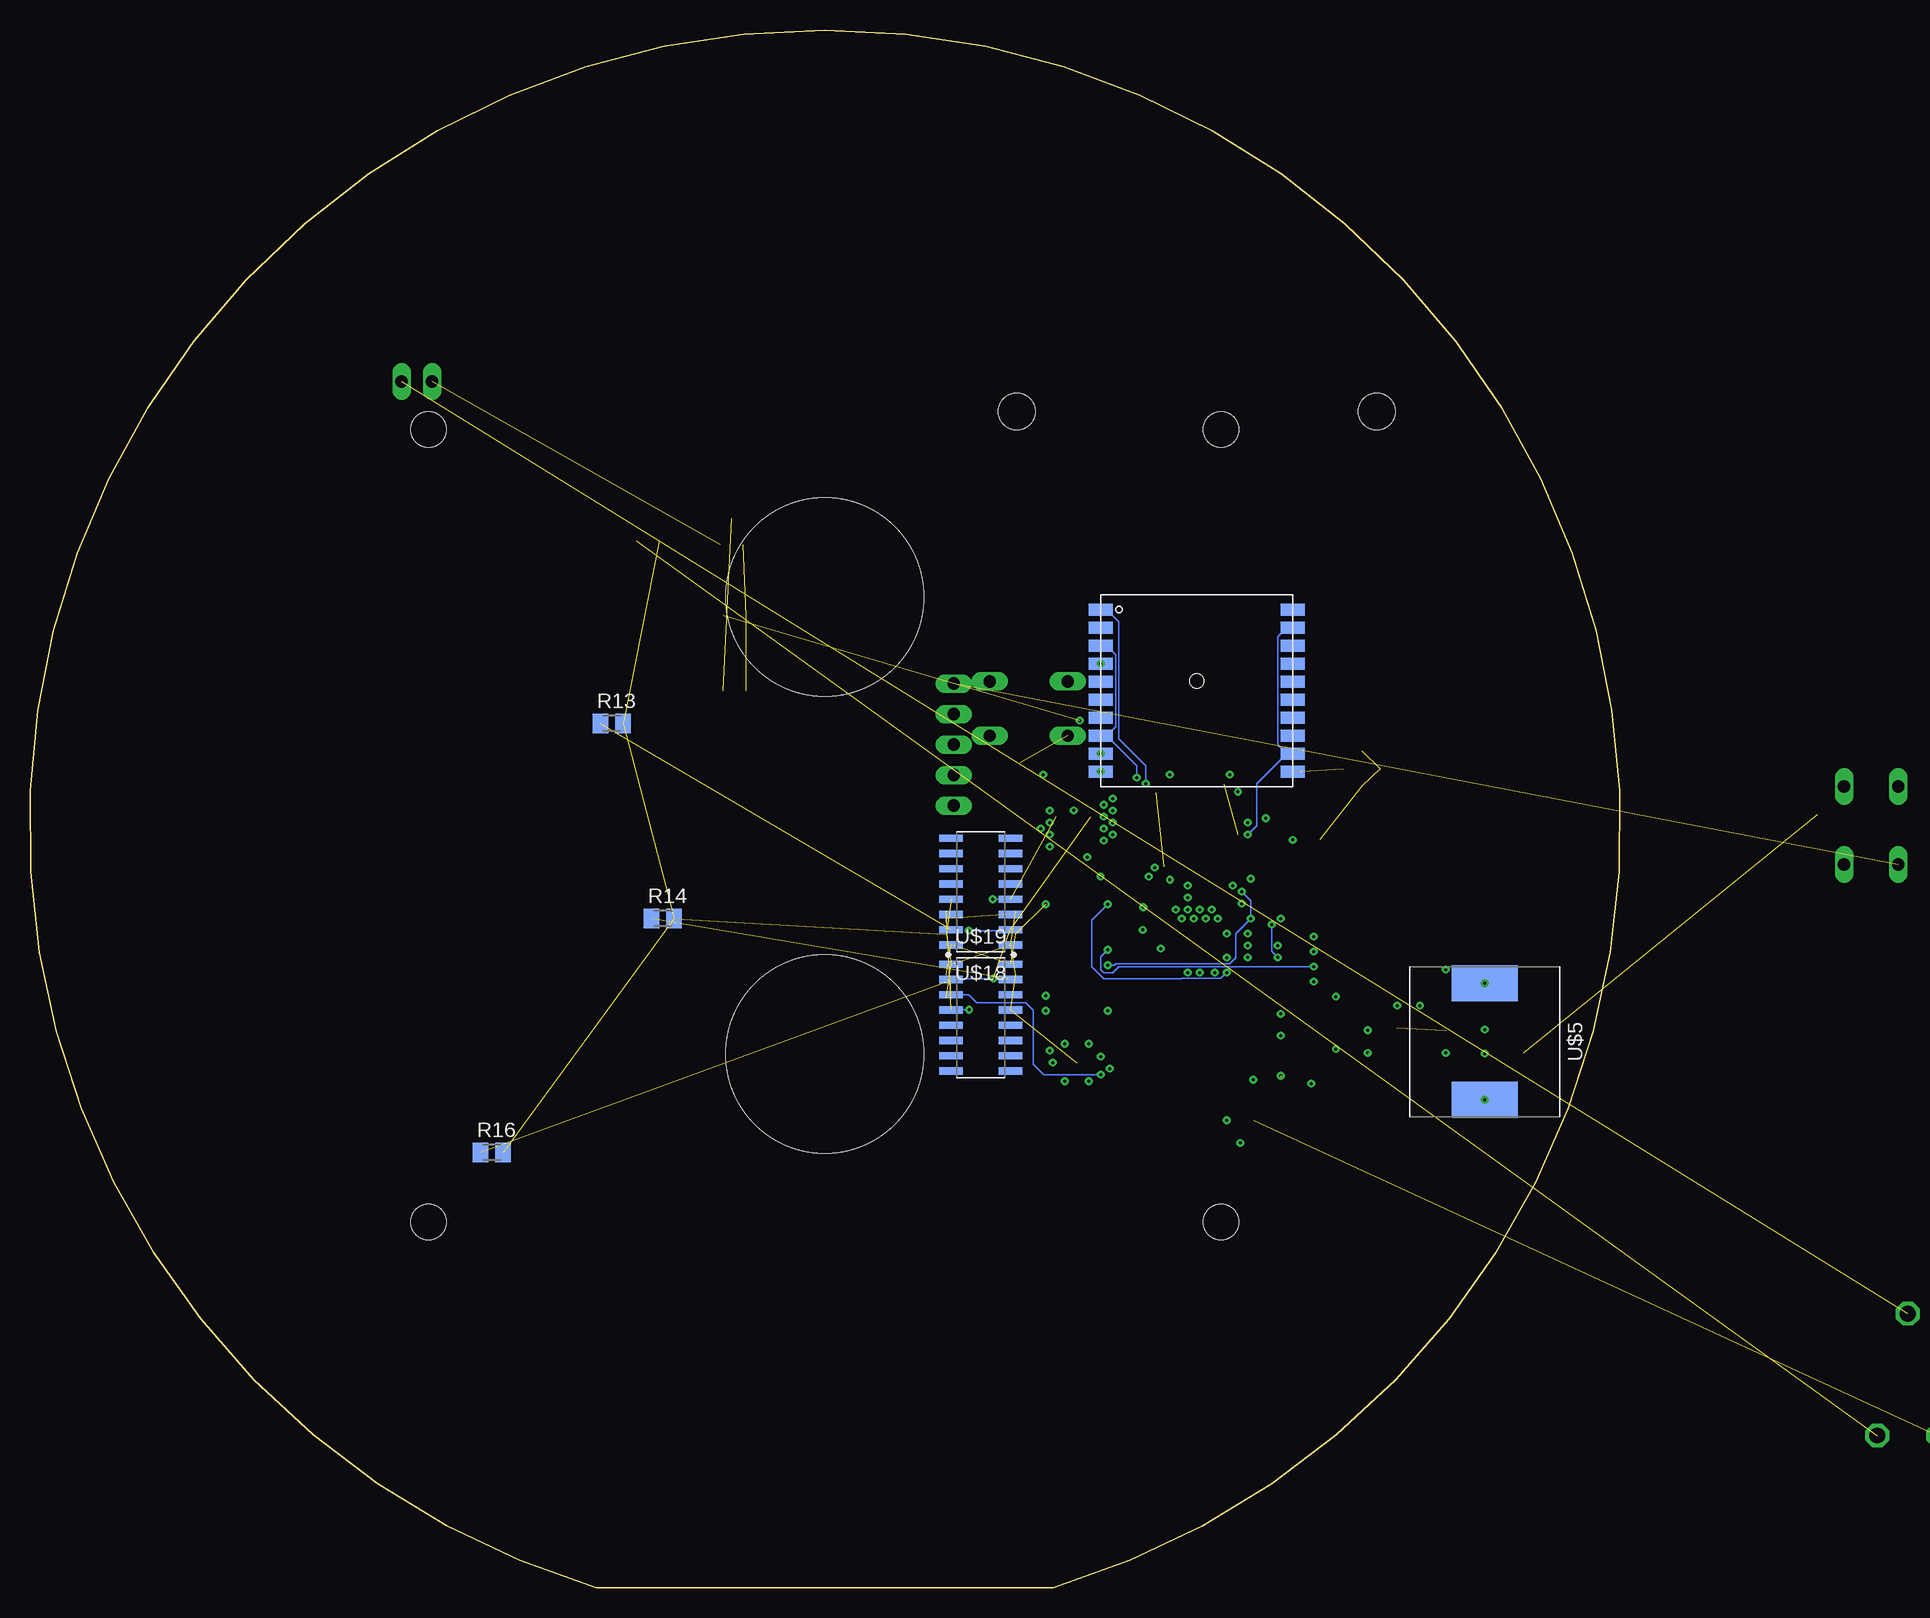
[diagram p7: board, bottom side, seen from below]

Size 132.46 x 129.8 mm. Coordinates in mm from the lower left corner, seen from the top.
Outline: 85.28,0 47.18,0 arc-327 85.28,0
Copper layers (1+2*15+16): Top 0.035mm / dielectric 1.5mm / Route2 0.035mm / dielectric 0.15mm / Route15 0.035mm / dielectric 0.2mm / Bottom 0.035mm
Design rules "default *": minimum track width 4mil, minimum drill 0.25mm, track to track 4mil, track to pad 4mil, pad to pad 4mil, via to via 4mil, smd to smd 4mil, copper to edge 20mil, drill to drill 4mil, minimum pad ring 10mil, minimum via ring 8mil, stop-mask expansion 4mil, vias tented up to drill 0mil, thermal gap 10mil
Holes 16.51 mm at 66.23,82.55 66.23,44.45
Holes 2.95 mm at 99.25,30.48 99.25,96.52 33.21,96.52 33.21,30.48

### Footprints (pad centres in the part's own frame; a part is rotated, then mirrored left to right if it is on the bottom)
C0805 = smd 1.3 x 1.5: 1 -0.95,0; 2 0.95,0
BEADC2012X105N = smd 1.2 x 1.45: 1 -0.85,0; 2 0.85,0
A1JB = smd 0.6 x 1.4: 1 1.525,0; 3 -1.525,0 | smd 2.2 x 1.05: 2 0,1.475; 4 0,-1.475
1X02 = drill 1.016 long: 1 -1.27,0; 2 1.27,0
1X05 = drill 1.016 long: 1 -5.08,0; 2 -2.54,0; 3 0,0; 4 2.54,0; 5 5.08,0
CHIP-LED0805 = smd 1.2 x 1.2: A 0,-1.05; C 0,1.05
M0805 = smd 1.3 x 1.6: 1 -0.95,0; 2 0.95,0
LI10 = drill 1.321 octagon: A -2.54,-5.08; E 2.54,-5.08; S 0,5.08
B3F-10XX = drill 1.016 long: 1 -3.251,2.261; 2 3.251,2.261; 3 -3.251,-2.261; 4 3.251,-2.261
QFN50P700X700X50-49T560N = smd 0.86 x 0.27: 1 -3.435,2.75; 2 -3.435,2.25; 3 -3.435,1.75; 4 -3.435,1.25; 5 -3.435,0.75; 6 -3.435,0.25; 7 -3.435,-0.25; 8 -3.435,-0.75; 9 -3.435,-1.25; 10 -3.435,-1.75; 11 -3.435,-2.25; 12 -3.435,-2.75; 25 3.435,-2.75; 26 3.435,-2.25; 27 3.435,-1.75; 28 3.435,-1.25; 29 3.435,-0.75; 30 3.435,-0.25; 31 3.435,0.25; 32 3.435,0.75; 33 3.435,1.25; 34 3.435,1.75; 35 3.435,2.25; 36 3.435,2.75 | smd 0.27 x 0.86: 13 -2.75,-3.435; 14 -2.25,-3.435; 15 -1.75,-3.435; 16 -1.25,-3.435; 17 -0.75,-3.435; 18 -0.25,-3.435; 19 0.25,-3.435; 20 0.75,-3.435; 21 1.25,-3.435; 22 1.75,-3.435; 23 2.25,-3.435; 24 2.75,-3.435; 37 2.75,3.435; 38 2.25,3.435; 39 1.75,3.435; 40 1.25,3.435; 41 0.75,3.435; 42 0.25,3.435; 43 -0.25,3.435; 44 -0.75,3.435; 45 -1.25,3.435; 46 -1.75,3.435; 47 -2.25,3.435; 48 -2.75,3.435 | smd 5.6 x 5.6: 49 0,0
SOT95P280X145-5 = smd 1.259 x 0.609: 1 -1.228,0.95; 2 -1.228,0; 3 -1.228,-0.95; 4 1.228,-0.95; 5 1.228,0.95
QFN40P300X300X105-25T159X175 = smd 0.635 x 0.203: 1 -1.496,1; 2 -1.496,0.6; 3 -1.496,0.2; 4 -1.496,-0.2; 5 -1.496,-0.6; 6 -1.496,-1; 13 1.496,-1; 14 1.496,-0.6; 15 1.496,-0.2; 16 1.496,0.2; 17 1.496,0.6; 18 1.496,1 | smd 0.203 x 0.635: 7 -1,-1.496; 8 -0.6,-1.496; 9 -0.2,-1.496; 10 0.2,-1.496; 11 0.6,-1.496; 12 1,-1.496; 19 1,1.496; 20 0.6,1.496; 21 0.2,1.496; 22 -0.2,1.496; 23 -0.6,1.496; 24 -1,1.496 | smd 1.59 x 1.75: 25 0,0
QFN50P450X250X100-21T300X100N = smd 0.27 x 0.86: 1 -0.25,2.185; 10 -0.25,-2.185; 11 0.25,-2.185; 20 0.25,2.185 | smd 0.86 x 0.27: 2 -1.185,1.75; 3 -1.185,1.25; 4 -1.185,0.75; 5 -1.185,0.25; 6 -1.185,-0.25; 7 -1.185,-0.75; 8 -1.185,-1.25; 9 -1.185,-1.75; 12 1.185,-1.75; 13 1.185,-1.25; 14 1.185,-0.75; 15 1.185,-0.25; 16 1.185,0.25; 17 1.185,0.75; 18 1.185,1.25; 19 1.185,1.75 | smd 1 x 3: 21 0,0
SOP95P280X110-6N = smd 1.265 x 0.497: 1 -1.273,0.95; 2 -1.273,0; 3 -1.273,-0.95; 4 1.273,-0.95; 5 1.273,0; 6 1.273,0.95
QFN50P300X250X100-15T150X100N = smd 0.27 x 0.86: 1 -0.25,1.435; 7 -0.25,-1.435; 8 0.25,-1.435; 14 0.25,1.435 | smd 0.86 x 0.27: 2 -1.185,1; 3 -1.185,0.5; 4 -1.185,0; 5 -1.185,-0.5; 6 -1.185,-1; 9 1.185,-1; 10 1.185,-0.5; 11 1.185,0; 12 1.185,0.5; 13 1.185,1 | smd 1 x 1.5: 15 0,0
INDDFN1250X1250X600-2N = smd 3.012 x 5.512: 1 -4.85,0; 2 4.85,0
SOIC127P600X265-16N = smd 1.765 x 0.592: 1 -2.575,4.445; 2 -2.575,3.175; 3 -2.575,1.905; 4 -2.575,0.635; 5 -2.575,-0.635; 6 -2.575,-1.905; 7 -2.575,-3.175; 8 -2.575,-4.445; 9 2.575,-4.445; 10 2.575,-3.175; 11 2.575,-1.905; 12 2.575,-0.635; 13 2.575,0.635; 14 2.575,1.905; 15 2.575,3.175; 16 2.575,4.445
SOT65P210X110-5 = smd 1.186 x 0.397: 1 -0.962,0.65; 2 -0.962,0; 3 -0.962,-0.65; 4 0.962,-0.65; 5 0.962,0.65
MS5607 = smd 1.1 x 0.6: P$1 -1.1,1.875; P$2 -1.1,0.625; P$3 -1.1,-0.625; P$4 -1.1,-1.875; P$5 1.1,-1.875; P$6 1.1,-0.625; P$7 1.1,0.625; P$8 1.1,1.875
SOIC127P1041X355-16N = smd 1.973 x 0.589: 1 -4.705,4.445; 2 -4.705,3.175; 3 -4.705,1.905; 4 -4.705,0.635; 5 -4.705,-0.635; 6 -4.705,-1.905; 7 -4.705,-3.175; 8 -4.705,-4.445; 9 4.705,-4.445; 10 4.705,-3.175; 11 4.705,-1.905; 12 4.705,-0.635; 13 4.705,0.635; 14 4.705,1.905; 15 4.705,3.175; 16 4.705,4.445
SOP95P280X145-6N = smd 1.209 x 0.584: 1 -1.253,0.95; 2 -1.253,0; 3 -1.253,-0.95; 4 1.253,-0.95; 5 1.253,0; 6 1.253,0.95
FGPMMOPA6H = smd 2 x 1: 1PPS 8,-3.75; 3D-FIX -8,0.75; EXT_ANT 8,-6.75; GND@3 -8,3.75; GND@8 -8,-3.75; GND@12 8,-5.25; GND@19 8,5.25; NC@6 -8,-0.75; NC@7 -8,-2.25; NC@15 8,-0.75; NC@16 8,0.75; NC@17 8,2.25; NC@18 8,3.75; NC@20 8,6.75; NRESET -8,5.25; RTCM 8,-2.25; RX -8,-6.75; TX -8,-5.25; VBACKUP -8,2.25; VCC -8,6.75
UXCELL_BUZZER = hole 3.048: -15,0; 15,0
SOT23 = smd 1 x 1.4: 1 -0.95,-1.1; 2 0.95,-1.1; 3 0,1.1
SOIC127P600X175-16N = smd 1.968 x 0.602: 1 -2.473,4.445; 2 -2.473,3.175; 3 -2.473,1.905; 4 -2.473,0.635; 5 -2.473,-0.635; 6 -2.473,-1.905; 7 -2.473,-3.175; 8 -2.473,-4.445; 9 2.473,-4.445; 10 2.473,-3.175; 11 2.473,-1.905; 12 2.473,-0.635; 13 2.473,0.635; 14 2.473,1.905; 15 2.473,3.175; 16 2.473,4.445
SOP65P640X120-24N = smd 1.572 x 0.407: 1 -2.872,3.575; 2 -2.872,2.925; 3 -2.872,2.275; 4 -2.872,1.625; 5 -2.872,0.975; 6 -2.872,0.325; 7 -2.872,-0.325; 8 -2.872,-0.975; 9 -2.872,-1.625; 10 -2.872,-2.275; 11 -2.872,-2.925; 12 -2.872,-3.575; 13 2.872,-3.575; 14 2.872,-2.925; 15 2.872,-2.275; 16 2.872,-1.625; 17 2.872,-0.975; 18 2.872,-0.325; 19 2.872,0.325; 20 2.872,0.975; 21 2.872,1.625; 22 2.872,2.275; 23 2.872,2.925; 24 2.872,3.575

### Placement (x,y rotation side)
C1  39.73,55.75 270 top
C2  -16.52,63.5 90 top  (outside the outline)
C3  7.98,45.5 270 top
C4  14.48,45.5 90 top
C5  17.58,42.5 180 top
C6  20.98,45.5 90 top
C7  17.58,48.5 0 top
C8  24.73,42 0 top
C9  34.98,38 270 top
C10  25.98,38 270 top
FB1  29.48,63.25 90 top
J1  21.48,68.25 0 top
JP1  100.23,100.5 0 top
JP2  55.48,70.25 90 top
LD1  27.73,67.75 90 top
LD2  27.73,66 90 top
LED1  111.98,93.75 0 top
LED2  105.73,93.75 0 top
LED3  99.48,93.75 0 top
LED4  93.23,93.75 0 top
R1  33.73,69.25 0 top
R2  28.23,43.47 270 top
R3  28.23,38 270 top
R4  30.48,38 270 top
R5  32.73,38 90 top
R6  28.23,48.75 90 top
R7  -24.02,17.75 0 top  (outside the outline)
R8  80.98,87.25 0 top
R9  73.73,81 0 top
R10  73.73,74.75 0 top
R11  24.98,63.25 270 top
R12  27.23,63.25 270 top
R13  83.98,72 0 bottom
R14  79.73,55.75 0 bottom
R15  48.98,66.5 180 top
R16  93.98,36.25 0 bottom
R17  48.98,69 180 top
S1  -20.97,63.5 270 top  (outside the outline)
S2  49.23,73.25 0 top
U0-C  35.23,63.5 0 top
U0-S  11.23,45.5 0 top
U1-S  17.98,45.5 0 top
U$1  45.23,63.5 180 top
U$2  41.98,59.25 0 top
U$3  35.23,53.5 270 top
U$4  45.23,43.75 0 top
U$5  11.23,45.5 270 bottom
U$6  45.23,52.5 0 top
U$7  15.48,51.25 270 top
U$8  17.98,51.25 270 top
U$9  20.48,51.25 270 top
U$10  22.98,51.25 270 top
U$11  24.73,45.5 0 top
U$12  35.23,45.5 0 top
U$13  29.73,53.5 0 top
U$14  29.48,57.5 0 top
U$15  35.23,74.75 0 bottom
U$16  35.23,98 180 top
U$17  73.98,88 0 top
U$18  53.23,58 180 bottom
U$19  53.23,47.5 0 bottom
U$20  53.23,58 180 top
U$21  53.23,47.5 0 top

### Tracks (layer width: path | path; a pad name or v marks a point on that pad's centre or on a via)
1V8  (via drill 0.25)  (1 unrouted)
  Top 0.127: U0-S.4 C4.1 | U1-S.8 17.38,43.38 17.45,43.32 17.45,41.52 16.58,40.65 U$5.2 | 20.93,44.5 U1-S.13 | U$9.5 21.13,50.6 20.68,51.05 19.03,51.05 18.63,50.65 U$8.5 18.63,50.6 18.18,51.05 16.53,51.05 16.13,50.65 U$7.5 16.13,49 C7.1
  Route2 0.127: C7.1 16.63,46.7 C4.1 | U$5.2 11.23,41.3 C4.1 | C6.1 C4.1
  other vias: 16.63,48.5 16.63,48.5 14.48,44.55 11.23,40.65 20.98,44.55
  pour Route2 (no thermals): 11.23,40.65 11.23,43.1 16.63,48.5 17.03,48.5 20.98,44.55 17.08,40.65
3V3  (via drill 0.25)  (5 unrouted)
  Top 0.127: U0-C.24 38.05,60 v38.73,60 | U$1.20 44.8,61.31 v44.36,60.88 | U$3.20 v38.23,53.25 | U0-C.36 39.23,66.25 39.48,66.5 v39.48,67 | C3.1 U0-S.1 10.05,46.5 v11.23,46.5 | U0-S.3 10.05,44.5 v11.23,44.5 | U$4.14 45.61,45.31 v46.23,45.31 | U$10.5 v23.63,49.25 U$11.P$1 23.36,47.38 22.73,46.75 22.73,43.05 C8.1 | U0-C.48 v32.48,67.75 | U$14.14 29.86,59.06 v30.73,59.06
  Route15 0.127: U$2.5 44.36,60.35 v44.36,60.88 | FB1.2 29.48,64.25 29.48,64.75
  Route15 0.508: v11.23,44.5 v11.23,46.5 12.23,45.5 20.98,45.5 23.63,48.15 v23.63,49.25 25.73,49.25 27.73,51.25 27.73,52.75 U$13.2 27.48,54.5 27.48,56.5 30.05,59.06 | v44.36,60.88 44.36,60.38 U$2.5 | v46.23,45.31 46.23,55.37 U$6.16 45.5,59.25 U$2.5 42.5,60 v38.73,60 38.23,60 | 30.05,59.06 v30.73,59.06 31.67,60 38.23,60 | v38.23,53.25 38.23,60 | FB1.2 30.05,63.53 30.05,59.06 | v32.48,67.75 32.23,67.75 29.48,65 29.48,64.25
  Bottom 0.127: U$15.VCC 42.73,81.5 41.73,80.5 41.73,70.75 39.48,68.5 v39.48,67
  other vias: 43.25,59.25 47.81,56.95 29.48,64.1 28.48,53.5
5V  (1 unrouted)
  Top 0.127: R4.1 30.48,41.01 U$12.8 32.88,41.05 C9.1
5V-MEASURE  (via drill 0.25)
  Top 0.127: R5.1 v31.61,37.05 R4.2 | U$13.4 v30.98,52.51
  Route15 0.127: v30.98,52.51 31.61,51.88 v31.61,37.05
!SPI1_REG!
  Top 0.127: U$2.4 42.28,58.3 41.48,57.5 41.48,54 39.8,52.31 U$3.19
!SPI2_REG!
  Top 0.127: U$1.1 45.48,60.75 44.93,60.2 U$2.6
ACCEL_ANALOG  (via drill 0.25)
  Top 0.127: U0-C.19 35.48,59 v35.98,58.5
  Route2 0.127: v35.98,58.5 35.23,58.5 32.98,56.25 32.98,55.5 33.23,55.25 33.23,54.07 32.66,53.5 U$13.5
  other vias: 30.99,53.5
ACCEL_ANALOG_OUT  (via drill 0.25)  (1 unrouted)
  Top 0.127: R3.1 28.23,39 | 28.23,39 R2.2 | C10.1 26.03,39 28.23,39 | v30.98,54.5 U$13.6 30.49,53.96 30.31,53.96 29.25,52.89 29.25,52.19 29.23,52.17 29.23,47 v28.23,46
  Route15 0.127: v28.23,42.64 v28.23,46
ACCEL_SEL
  Top 0.127: U$14.8 29.73,55 29.18,54.45 U$13.1 27.93,54.45 27.48,54 27.48,51.25 28.23,50.5 R6.2
ARMING_EN  (via drill 0.25)
  Top 0.127: U0-C.6 v30.98,63.75
BATT_MEAS  (via drill 0.25)
  Top 0.127: U0-C.18 34.98,58.5 v35.98,57.5
BOOT0
  Top 0.127: U0-C.44 34.48,69.05 R1.2
BUTTON_IN  (1 unrouted)
  Top 0.127: U0-C.32 39.23,64.25 40.98,66 40.98,66.25 42.23,67.5 42.23,69.75 43.47,70.99 S2.3
BUZZER_OUT  (via drill 0.25)  (1 unrouted)
  Top 0.127: U0-C.33 39.23,64.75 40.61,66.12 40.61,66.38 41.73,67.5 41.73,70.07 43.91,72.25 v44.98,72.25
CS_1V8
  Top 0.127: U1-S.22 17.78,47.62 17.72,47.68 17.72,49.32 17.9,49.5 19.48,49.5 19.83,49.85 U$9.4
EXT-ANT  (1 unrouted)
FIRE_A
  Top 0.127: U0-C.40 36.48,69
FIRE_B
  Top 0.127: U0-C.41 35.98,67.5 36.23,67.75 36.23,69
FIRE_C
  Top 0.127: U0-C.42 35.48,67.5 35.98,68 35.98,69
FIRE_D
  Top 0.127: U0-C.43 34.98,67.5 35.73,68.25 35.73,69
GND  (via drill 0.25)  (19 unrouted)
  Top 0.127: U0-C.23 37.48,59.75 37.98,59.25 v39.23,59.25 U$2.2 | U0-C.35 39.23,65.75 39.86,66.38 39.86,66.62 40.23,67 v40.23,67.5 | 33.98,53.75 U$3.10 32.73,54.06 v32.73,54.5 | 33.98,53.75 34.98,53.75 U$3.21 | 33.98,52 U$3.13 33.98,53.75 | U$1.4 45.23,62.75 45.23,63.25 | 45.23,63.25 U$1.21 | C3.2 8.93,45.5 U0-S.2 13.53,45.5 C4.2 15.86,45.08 15.86,43.27 C5.2 | 45.48,63.5 45.23,63.25 | U$1.21 45.23,64.5 v45.49,64.76 | v44.23,42.19 44.85,42.19 U$4.7 44.98,43.5 U$4.15 | 18.58,46.65 U1-S.20 18.58,48.45 C7.2 | U1-S.18 20.93,46.5 C6.2 | U$10.3 22.33,51.85 21.93,51.45 20.22,51.45 19.83,51.84 U$9.3 19.83,51.85 19.43,51.45 17.72,51.45 17.33,51.84 17.33,51.85 | 17.33,51.85 16.93,51.45 15.22,51.45 14.83,51.84 U$7.3 14.83,51.85 v14.48,51.5 | U$8.3 17.33,51.85 | S1.3 S1.4 | S1.4 | C2.2 -19.03,64.45 S1.4 | C8.2 24.73,42.95 24.73,44 23.86,44.88 U$11.P$3 U$11.P$2 | U0-C.8 v30.98,62.75 | U0-C.47 32.98,69.05 R1.1 | U$14.15 29.23,57.25 U$14.7 29.23,55.5 v28.98,55.25 | C10.2 R3.2 28.41,37.05 29.36,38 31.61,38 32.56,38.95 R5.2 32.91,38.95 34.81,37.05 C9.2 | U$1.21 45.48,63.75 U$1.10 | R11.2 R12.2 | U$20.21 49.74,56.38 | 48.03,66.62 R15.2 v48.03,67.75 R17.2
  Top 0.508: U$13.3 v28.48,52.51
  Route2 0.127: 39.73,53.5 C1.2 40.23,55.3 40.23,57.25 | v14.48,51.5 17.48,48.5 C7.2 18.93,48.5 | 31.23,55.25 30.23,55.25 | C8.2 25.73,42 | 38.48,59.25 37.98,59.25 37.36,59.88 | v44.23,42.19 35.97,42.19 R5.2 | 45.49,66.21 47.03,67.75 v48.03,67.75
  Route2 0.508: 18.93,48.5 C6.2 22.56,44.88 U$11.P$3 25.73,42.77 25.73,42 30.2,42 U$12.7 | R5.2 32.73,40.12 U$12.7 | R6.1 30.53,45.5 | 30.53,45.5 U$12.7 | 30.53,45.5 40.11,45.5 U$6.8 39.73,50.98 39.73,53.5 | 40.23,58.25 v39.23,59.25 38.48,59.25 | 40.23,58.25 40.23,57.25 | v45.49,64.76 45.49,63.51 40.23,58.25 | 37.36,59.88 34.48,62.75 v30.98,62.75 28.98,60.75 | R12.2 27.43,62.3 28.98,60.75 | 28.98,60.75 v28.98,55.25 30.23,55.25 | v32.73,54.5 31.98,55.25 31.23,55.25 | v45.49,64.76 42.75,67.5 v40.23,67.5 | v45.49,64.76 45.49,66.21
  Bottom 0.127: v40.23,67.5 40.23,68.5 42.73,71 | U$15.GND@12 27.73,69.5 | 27.73,69.5 30.23,67 30.23,63.5 v30.98,62.75 | 27.73,69.5 28.48,70.25 28.48,79.25 27.73,80 U$15.GND@19 | 42.73,71 41.98,71.75 41.98,77.75 42.73,78.5 U$15.GND@3 | U$15.GND@8 42.73,71 | v28.98,55.25 28.98,53.01 v28.48,52.51
  other vias: 20.98,46.45 39.73,54.8 18.53,48.5 23.63,44.88 30.53,42.33 32.73,38.95 28.23,47.8 25.68,42 25.68,42 42.66,48.05 27.23,62.3
  pour Route2: 17.48,48.5 27.48,38.5 35.98,38.5 42.48,45 43.48,45 43.98,45.5 43.98,58.75 46.98,61.75 46.98,64.75 46.23,65.5 44.23,65.5 43.48,64.75 43.48,62 40.73,59.25 37.98,59.25 37.98,59 40.23,56.75 40.23,55.5 39.73,55 39.73,54 35.23,49.5 17.98,49.5 17.48,49
HDD_CHECK  (via drill 0.25)
  Top 0.127: U0-C.38 v37.48,67.75
LD1
  Top 0.127: U0-C.4 31.48,64.75 28.78,67.45 LD1.A
LD2
  Top 0.127: U0-C.5 31.48,64.25 29.73,66 LD2.A
MISO_1V8
  Top 0.127: U1-S.9 17.78,43.38 17.72,43.32 17.72,41.52 17.98,41.25 19.31,41.25 21.93,43.87 21.93,51.1 22.28,51.45 22.68,51.45 22.98,51.75 U$10.2
MOSI_1V8
  Top 0.127: 16.98,47.22 U1-S.24 16.5,47 15.73,47.77 15.73,49 14.83,49.9 U$7.4 14.83,49.79
N$1  (1 unrouted)
N$2  (1 unrouted)
N$3  (1 unrouted)
N$4  (2 unrouted)
N$5  (1 unrouted)
N$6
  Top 0.127: R11.1 24.98,66 26.68,67.7 LD1.C
N$7
  Top 0.127: LD2.C 26.68,65.55 27.23,65 R12.1
N$8  (1 unrouted)
N$9  (1 unrouted)
N$10
  Top 0.127: 49.93,66.3 R15.1 49.93,65.45 49.36,64.88 49.36,55.5 49.78,55.08 U$20.23
N$11  (1 unrouted)
N$28
  Top 0.127: U$20.20 51.23,57.02 53.11,58.9 53.11,62.25
N$29
  Top 0.127: U$20.19 51.23,57.67 52.86,59.3 52.86,62.25
N$30
  Top 0.127: U$20.18 51.23,58.33 52.61,59.7 52.61,62.25
N$31
  Top 0.127: U$20.17 51.23,58.98 52.36,60.1 52.36,62.25
N$32
  Top 0.127: U$20.16 51.23,59.62 52.11,60.5 52.11,62.25
N$33
  Top 0.127: U$20.15 51.23,60.27 51.86,60.9 51.86,62.25
N$34
  Top 0.127: U$20.14 51.23,60.92 51.61,61.3 51.61,62.25
N$35
  Top 0.127: U$20.13 51.06,61.58 51.36,61.88 51.36,62.25
N$36
  Top 0.127: U$21.20 55.23,48.48 53.36,46.6 53.36,42.62
N$37
  Top 0.127: U$21.19 55.23,47.83 53.61,46.2 53.61,42.62
N$38
  Top 0.127: U$21.18 55.23,47.17 53.84,45.78 53.84,42.62
N$39
  Top 0.127: U$21.17 55.23,46.52 54.11,45.4 54.11,42.62
N$40
  Top 0.127: U$21.16 55.23,45.88 54.34,44.98 54.34,42.62
N$41
  Top 0.127: U$21.15 55.23,45.23 54.61,44.6 54.61,42.62
N$42
  Top 0.127: U$21.14 55.23,44.58 54.86,44.2 54.86,42.62
N$43
  Top 0.127: U$21.13 55.23,43.92 55.11,43.8 55.11,42.62
N$44
  Top 0.127: U$21.5 51.23,48.48 53.11,46.6 53.11,42.62
N$45
  Top 0.127: U$21.6 51.23,47.83 52.88,46.18 52.88,42.62
N$46
  Top 0.127: U$21.7 51.23,47.17 52.61,45.8 52.61,42.62
N$47
  Top 0.127: U$21.8 51.23,46.52 52.36,45.4 52.36,42.62
N$48
  Top 0.127: U$21.9 51.23,45.88 52.11,45 52.11,42.62
N$49
  Top 0.127: U$21.10 51.23,45.23 51.86,44.6 51.86,42.62
N$50
  Top 0.127: U$21.11 51.23,44.58 51.61,44.2 51.61,42.62
N$51
  Top 0.127: U$21.12 51.23,43.92 51.36,43.8 51.36,42.62
N$52
  Top 0.127: U$20.5 55.23,57.02 53.36,58.9 53.36,62.25
N$53
  Top 0.127: U$20.6 55.23,57.67 53.61,59.3 53.61,62.25
N$54
  Top 0.127: U$20.7 55.23,58.33 53.86,59.7 53.86,62.25
N$55
  Top 0.127: U$20.8 55.23,58.98 54.11,60.1 54.11,62.25
N$56
  Top 0.127: U$20.9 55.23,59.62 54.36,60.5 54.36,62.25
N$57
  Top 0.127: U$20.10 55.23,60.27 54.61,60.9 54.61,62.25
N$58
  Top 0.127: U$20.11 55.23,60.92 54.86,61.3 54.86,62.25
N$59
  Top 0.127: U$20.12 55.41,61.58 55.11,61.88 55.11,62.25
N$60
  Top 0.127: S2.4 52.05,70.99 50.06,69 R17.1
NRST
  Top 0.127: -16.41,62.55 C2.1 -16.52,62.44 | U0-C.7 -15.57,63.25 -16.27,62.55 -16.41,62.55 | S1.2 -16.41,62.55
SCK_1V8
  Top 0.127: 17.38,47.22 U1-S.23 17.38,47.62 17.45,47.68 17.45,49.32 17.33,49.43 U$8.4
SENSE_A
  Top 0.127: U0-C.3 31.48,65.25 30.73,66 30.73,67
SENSE_B
  Top 0.127: U0-C.2 31.48,65.75 30.98,66.25 30.98,67
SENSE_C
  Top 0.127: U0-C.46 33.48,68.27 33.64,68.42 33.64,70.09 33.48,70.25 33.48,70.5
SENSE_D
  Top 0.127: U0-C.45 33.98,68.27 33.87,68.38 33.87,70.14 33.98,70.25 33.98,70.5
SPI1_CS0  (via drill 0.25)
  Top 0.127: U$6.5 43.37,51.87 | U$14.9 30.73,56.44 v30.73,55.75 | U$14.12 v31.48,58
  Bottom 0.127: v31.48,58 30.73,57.25 v30.73,55.75 31.98,54.5 31.98,52.5 32.48,52 41.98,52 42.12,51.87 U$6.5
  other vias: 42.66,51.87
SPI1_CS1  (via drill 0.25)
  Top 0.127: U$6.4 43.35,53.13 | 20.48,51.75 U$9.2 20.48,52.75 20.73,53 24.23,53 v25.48,51.75
  Bottom 0.127: U$6.4 43.23,52.56 43.23,51.5 42.98,51.25 42.23,51.25 41.73,51.75 v25.48,51.75
  other vias: 42.66,53.13
SPI1_CS2
  Top 0.127: U$6.3 43.33,54.41 43.73,54 43.73,46.75 42.5,45.52 42.5,44.52 40.98,43 29.43,43 29.1,43.34 26.9,43.34 26.61,43.62 U$11.P$5
SPI1_CS3
  Top 0.127: U$6.2 43.31,55.67
SPI1_LE  (via drill 0.25)
  Top 0.127: U$3.2 v36.98,56.5 36.98,58.25 35.98,59.25 U0-C.20 | v35.98,51.25 U$3.17
  Route2 0.127: v36.98,56.5 36.98,52.25 v35.98,51.25
SPI1_MISO  (via drill 0.25)
  Top 0.127: U$3.7 v34.48,55.75 34.48,56.75 33.98,57.25 U0-C.16 | U$3.14 34.48,52 v33.73,51.25
  Route2 0.127: v33.73,51.25 33.73,53.25 34.48,54 v34.48,55.75
SPI1_MOSI  (via drill 0.25)
  Top 0.127: U$3.4 v35.98,56.5 34.48,58 U0-C.17 | U$3.15 v34.98,51.25
  Route2 0.127: v34.98,51.25 34.98,53 35.98,54 v35.98,56.5
SPI1_REG
  Top 0.127: U0-C.21 36.48,59.25 37.48,58.25 | 37.48,58.25 40.66,58.25 U$2.3 | U$3.1 37.48,53.81 37.48,58.25
SPI1_SCK  (via drill 0.25)
  Top 0.127: U$3.8 v33.98,56.5 33.48,57 U0-C.15 | U$3.11 32.73,52.94 v32.73,52.5
  Route2 0.127: v32.73,52.5 32.73,52.75 33.98,54 v33.98,56.5
SPI1B_LE  (via drill 0.25)
  Top 0.127: U$3.3 v36.48,55.75 | U$14.10 v31.48,57
  Route15 0.127: v31.48,57 33.23,55.25 35.98,55.25 v36.48,55.75
SPI1B_MISO  (via drill 0.25)
  Top 0.127: U$3.6 v34.98,56.5 | U$10.4 22.33,50.6 22.78,51.05 24.93,51.05 v25.48,50.5 24.73,49.75 24.73,45.75 25.61,44.88 U$11.P$6 | U$14.6 28.23,56.44 v28.23,55.75
  Route2 0.127: v34.98,56.5 34.98,54 34.22,53.24 34.22,51.01 33.72,50.5 v25.48,50.5
  Route15 0.127: v28.23,55.75 29.98,57.5 33.98,57.5 v34.98,56.5
SPI1B_MOSI  (via drill 0.25)
  Top 0.127: U$3.5 v35.48,55.75 | U$7.2 15.48,52.75 16.23,53.5 24.73,53.5 v25.48,54.25 26.73,53 26.73,46.75 26.11,46.12 U$11.P$7 | U$14.13 v32.23,58.5
  Route2 0.127: v35.48,55.75 35.48,54 34.48,53 34.48,50.75 33.48,49.75 25.23,49.75 24.73,50.25 24.73,53.5 v25.48,54.25
  Route15 0.127: v32.23,58.5 33.98,58.5 35.48,57 v35.48,55.75
SPI1B_SCK  (via drill 0.25)
  Top 0.127: v33.48,55.75 U$3.9 | U$8.2 17.98,52.75 18.48,53.25 25.23,53.25 v25.48,53 26.48,52 26.48,47.75 26.11,47.38 U$11.P$8
  Route2 0.127: v33.48,55.75 33.48,54 32.48,53 v25.48,53
SPI1R_LE
  Top 0.127: U$6.6 37.64,50.59 36.48,51.75 U$3.18
SPI1R_MOSI
  Top 0.127: U$3.16 35.48,51 37.16,49.33 U$6.7
SPI1R_SCK  (via drill 0.25)
  Top 0.127: U$3.12 33.48,52 v32.73,51.25
  Route2 0.127: 42.66,56.92 U$6.1
  Bottom 0.127: v32.73,51.25 33.22,50.76 36.47,50.76 36.48,50.75 42.98,50.75 43.98,51.75 43.98,55.62 U$6.1
  other vias: 42.66,56.95
SPI2_CS0
  Top 0.127: U$4.4 42.98,43.75 42.73,44 42.73,45.25 45.98,48.5 45.98,51.88 47.23,53.13 U$6.13
SPI2_CS1
  Top 0.127: 48.35,51.87 U$6.12 47.23,51.87 46.23,50.87 46.23,48.25 43.73,45.75 43.73,44.75 U$4.2
SPI2_CS2
  Top 0.127: 48.33,50.59 U$6.11 47.23,50.59 46.48,49.84 46.48,46 46.98,45.5 46.98,45 46.73,44.75 U$4.13
SPI2_CS3  (via drill 0.25)
  Top 0.127: 46.73,42.75 U$4.9 47.48,42.75 47.98,43.25 47.98,46.25 46.73,47.5 46.73,48.83 47.23,49.33 U$6.10 47.73,49.25 47.23,49.25
  other vias: 47.81,49.33
SPI2_LE  (via drill 0.25)
  Top 0.127: U$1.8 v47.48,64.75 | U$1.11 44.92,65.75 v42.23,65.75 39.23,62.75 U0-C.29
  Route15 0.127: v47.48,64.75 46.48,65.75 v42.23,65.75
SPI2_MISO  (via drill 0.25)
  Top 0.127: U$1.5 46.78,63.25 | U$1.5 46.73,63.25 | U$1.5 v48.23,63.25 | U$1.16 v42.98,63.25 41.98,63.25 40.48,61.75 U0-C.27
  Route15 0.127: v48.23,63.25 v42.98,63.25
SPI2_MOSI  (via drill 0.25)
  Top 0.127: U$1.6 v47.48,63.75 | U$1.13 v42.23,64.75 39.73,62.25 U0-C.28
  Route15 0.127: v42.23,64.75 44.73,64.75 45.73,63.75 v47.48,63.75
SPI2_REG
  Top 0.127: 38.98,60.75 U0-C.25 39.73,60.75 40.28,60.2 U$2.1 41.18,60.2 41.73,60.75 43.48,60.75 43.98,61.25 43.98,61.69 U$1.19
SPI2_SCK  (via drill 0.25)
  Top 0.127: U$1.2 v47.48,61.75 | U$1.17 v42.23,62.75 40.73,61.25 U0-C.26 | U$4.1 44.85,45.31 v44.23,45.31 | U$4.10 47.48,43.25 47.73,43.5 47.73,44 47.48,44.25 | U$4.12 47.23,44.25 | 47.23,44.25 47.48,44.25 | U$4.5 v42.48,43.25 | 47.48,44.5 v47.48,44.75 | 47.48,44.5 47.36,44.38 | 47.36,44.38 47.23,44.25 | 47.48,44.25 47.48,44.5 | 47.48,44.25 47.36,44.38
  Route2 0.127: v42.48,43.25 42.48,44.5 42.73,44.75 43.67,44.75 v44.23,45.31 44.23,58.5 v47.48,61.75
  Route15 0.127: v47.48,61.75 46.48,62.75 v42.23,62.75 | v47.48,44.75 44.8,44.75 v44.23,45.31
SPI2_SCK0  (via drill 0.25)  (2 unrouted)
  Top 0.127: U$4.6 v43.23,42.75
  Bottom 0.127: U$19.3 54.23,49.41 53.58,48.75 49.48,48.75 48.86,48.12 48.86,43.62 47.98,42.75 v43.23,42.75
SPI2_SCK1  (via drill 0.25)
  Top 0.127: U$4.3 v43.23,44.25
SPI2_SCK2  (via drill 0.25)
  Top 0.127: U$4.11 v47.23,43.75
SPI2_SCK3  (via drill 0.25)
  Top 0.127: U$4.8 45.61,42.19 v46.23,42.19 47.42,42.19 48.86,43.62 48.86,49.12 49.48,49.75 50.33,49.75 U$21.3
SPI2B_LE  (via drill 0.25)  (2 unrouted)
  Top 0.127: U$1.12 44.04,65.24 v42.98,65.24 | v52.23,57.37 53.22,56.38 U$20.4 | v54.21,48.15 53.24,49.12 U$21.4
  Route15 0.127: v42.98,65.24 45.28,65.24 45.29,65.25 45.98,65.25 46.98,64.25
  Bottom 0.127: U$18.4 v52.23,57.37 | U$19.4 54.23,48.13 v54.21,48.15
SPI2B_MISO  (via drill 0.25)
  Top 0.127: U$1.15 v42.23,63.75
SPI2B_MOSI  (via drill 0.25)  (2 unrouted)
  Top 0.127: U$1.14 v42.98,64.25 | U$20.2 54.56,55.08 v54.23,54.75 | U$21.2 51.85,50.42 v52.17,50.75
  Bottom 0.127: v54.23,54.75 50.83,54.75 U$18.2 | U$19.2 55.63,50.75 v52.17,50.75
SPI2B_SCK  (via drill 0.25)
  Top 0.127: 43.73,62.25 U$1.18 v42.98,62.25
SPI2R_LE
  Top 0.127: U$1.9 47.73,65.25 49.11,63.88 49.11,55.12 48.39,54.41 U$6.14
SPI2R_MOSI
  Top 0.127: U$1.7 46.42,64.24 48.24,64.24 48.86,63.62 48.86,56.08 48.45,55.67 U$6.15
SPI2R_SCK  (via drill 0.25)
  Top 0.127: U$1.3 46.98,62.25 v47.48,62.75 | U$6.9 47.18,48.05
  Route2 0.127: v47.48,62.75 48.48,61.75 48.48,48.73 U$6.9
  other vias: 47.81,48.05
ST
  Top 0.127: U$14.11 31.73,57.5 31.98,57.25 31.98,46.75 31.37,46.14 U$12.4
STATUS
  Top 0.127: U$12.6 27.5,43.59 26.98,44.11 26.98,56.25 27.73,57 U$14.5
SWCLK
  Top 0.127: 45.48,73.25 45.23,73.25 43.23,73.25 37.98,68 U0-C.37
SWDIO
  Top 0.127: U0-C.34 39.23,65.25 40.23,66.25 40.23,66.5 41.25,67.52 41.25,70.42 43.83,73 45.48,73
SWO
  Top 0.127: U0-C.39 36.98,68.25 42.23,73.5 45.73,73.5
U0-S_SW  (via drill 0.25)
  Top 0.127: U$5.1 12.46,49.12 U0-S.5
  other vias: 11.23,50.35
U0-S_VOUT
  Top 0.127: R2.1 28.68,44.86 U$12.5
U1-S_REGOUT
  Top 0.127: U1-S.10 18.18,42.85 C5.1
USART1_RX  (via drill 0.25)
  Top 0.127: U0-C.31 39.23,63.75 41.36,65.88 41.36,66.12 42.73,67.5 42.73,69 U$15.TX
  other vias: 43.23,69.5
USART1_TX  (via drill 0.25)
  Top 0.127: U0-C.30 39.23,63.25 41.73,65.75 41.73,66 43.23,67.5 U$15.RX
  other vias: 43.23,68
USART2_CTS
  Top 0.127: U0-C.10 31.23,61.75 29.98,60.5 26.48,60.5
USART2_RTS
  Top 0.127: U0-C.11 31.23,61.25 30.23,60.25 26.48,60.25
USART2_RX
  Top 0.127: U0-C.13 32.48,59.75 32.23,59.5 31.23,59.5 30.98,59.75 26.48,59.75
USART2_TX
  Top 0.127: U0-C.12 31.23,60.75 30.48,60 26.48,60
VBAT  (via drill 0.25)
  Top 0.127: U0-C.1 v31.8,66.31
  Route2 0.127: U$15.VBACKUP 32.55,66.31 v31.8,66.31
  Route15 0.127: v31.8,66.31
  other vias: 43.23,77
VCAP_1  (via drill 0.25)
  Top 0.127: U0-C.22 36.98,59.47 v37.47,58.99
  Top 0.152: C1.1 v39.69,56.7
  Route2 0.152: v37.47,58.99 39.69,56.77 v39.69,56.7
VDDA
  Top 0.127: U0-C.9 30.23,62.25 | 30.23,62.25 29.63,62.25 | 29.83,62.4 FB1.1 30.08,62.4 30.23,62.25